# EAGLE board 68EC020TK-V01 (EAGLE 6.6.0), part 1 of 2
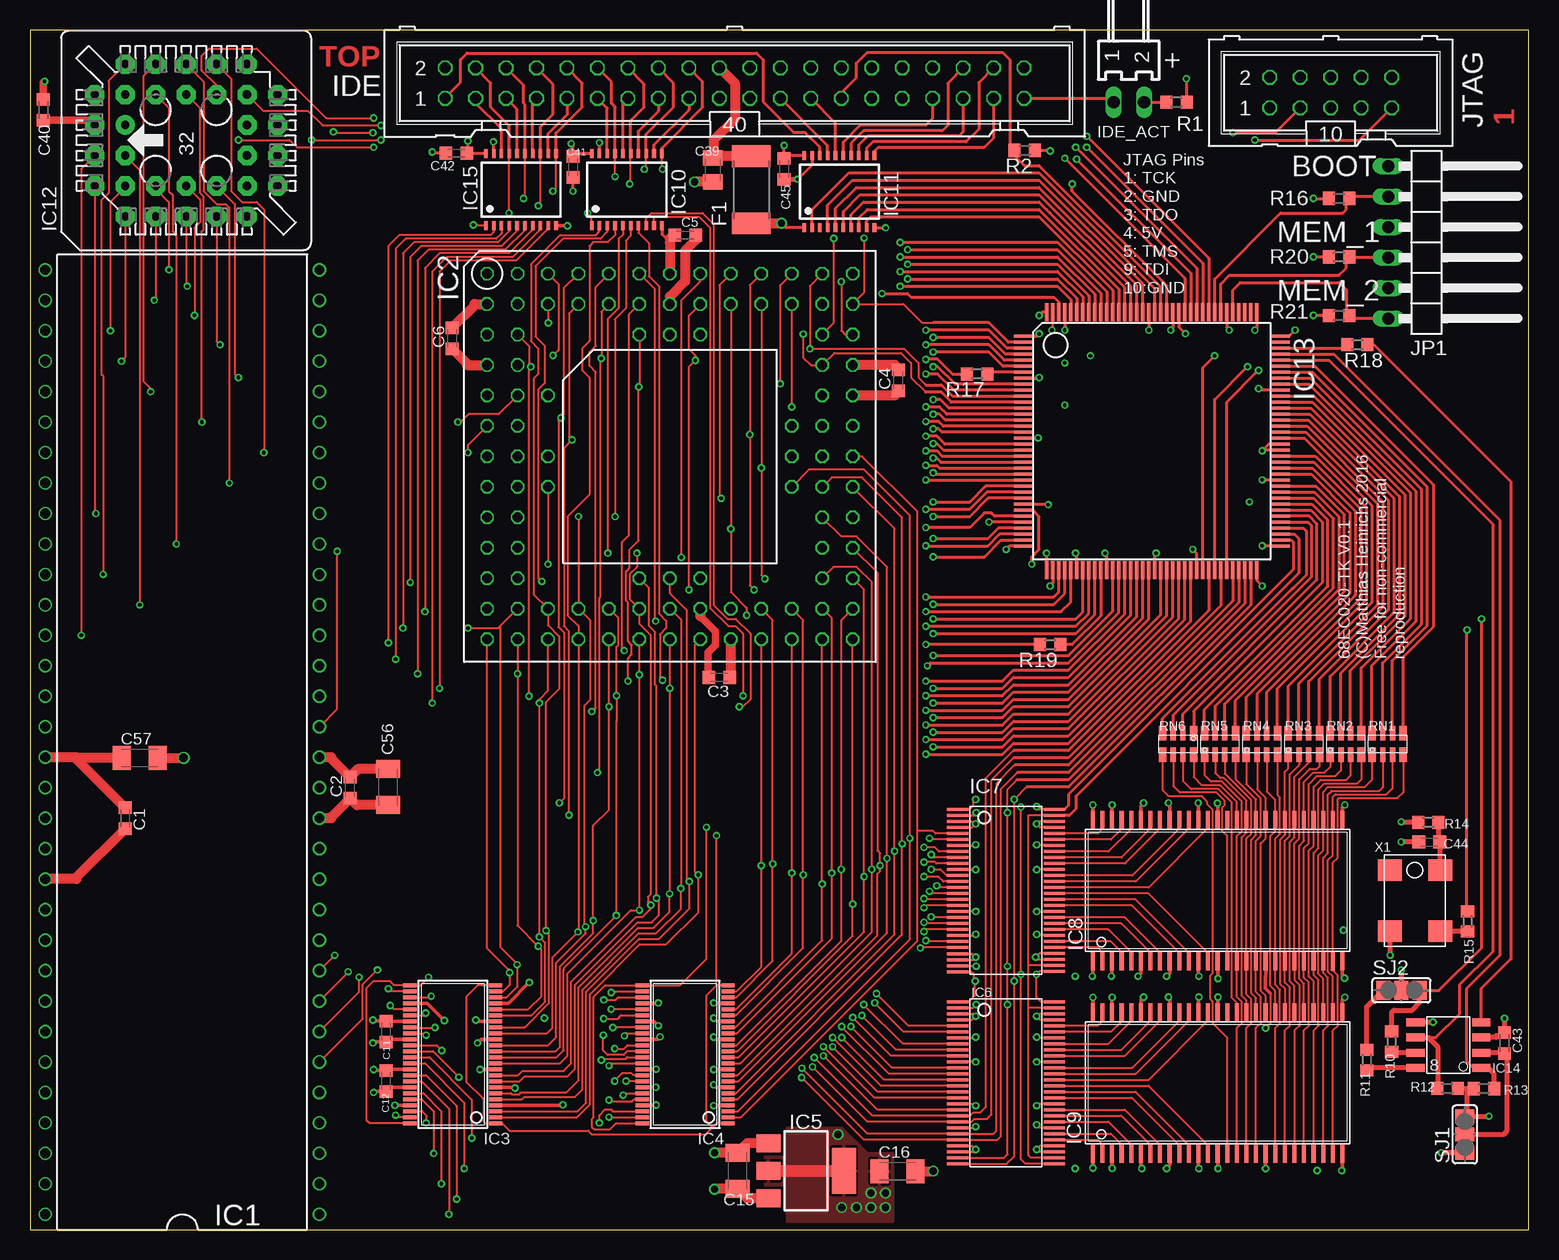
[diagram p4: board, top side]
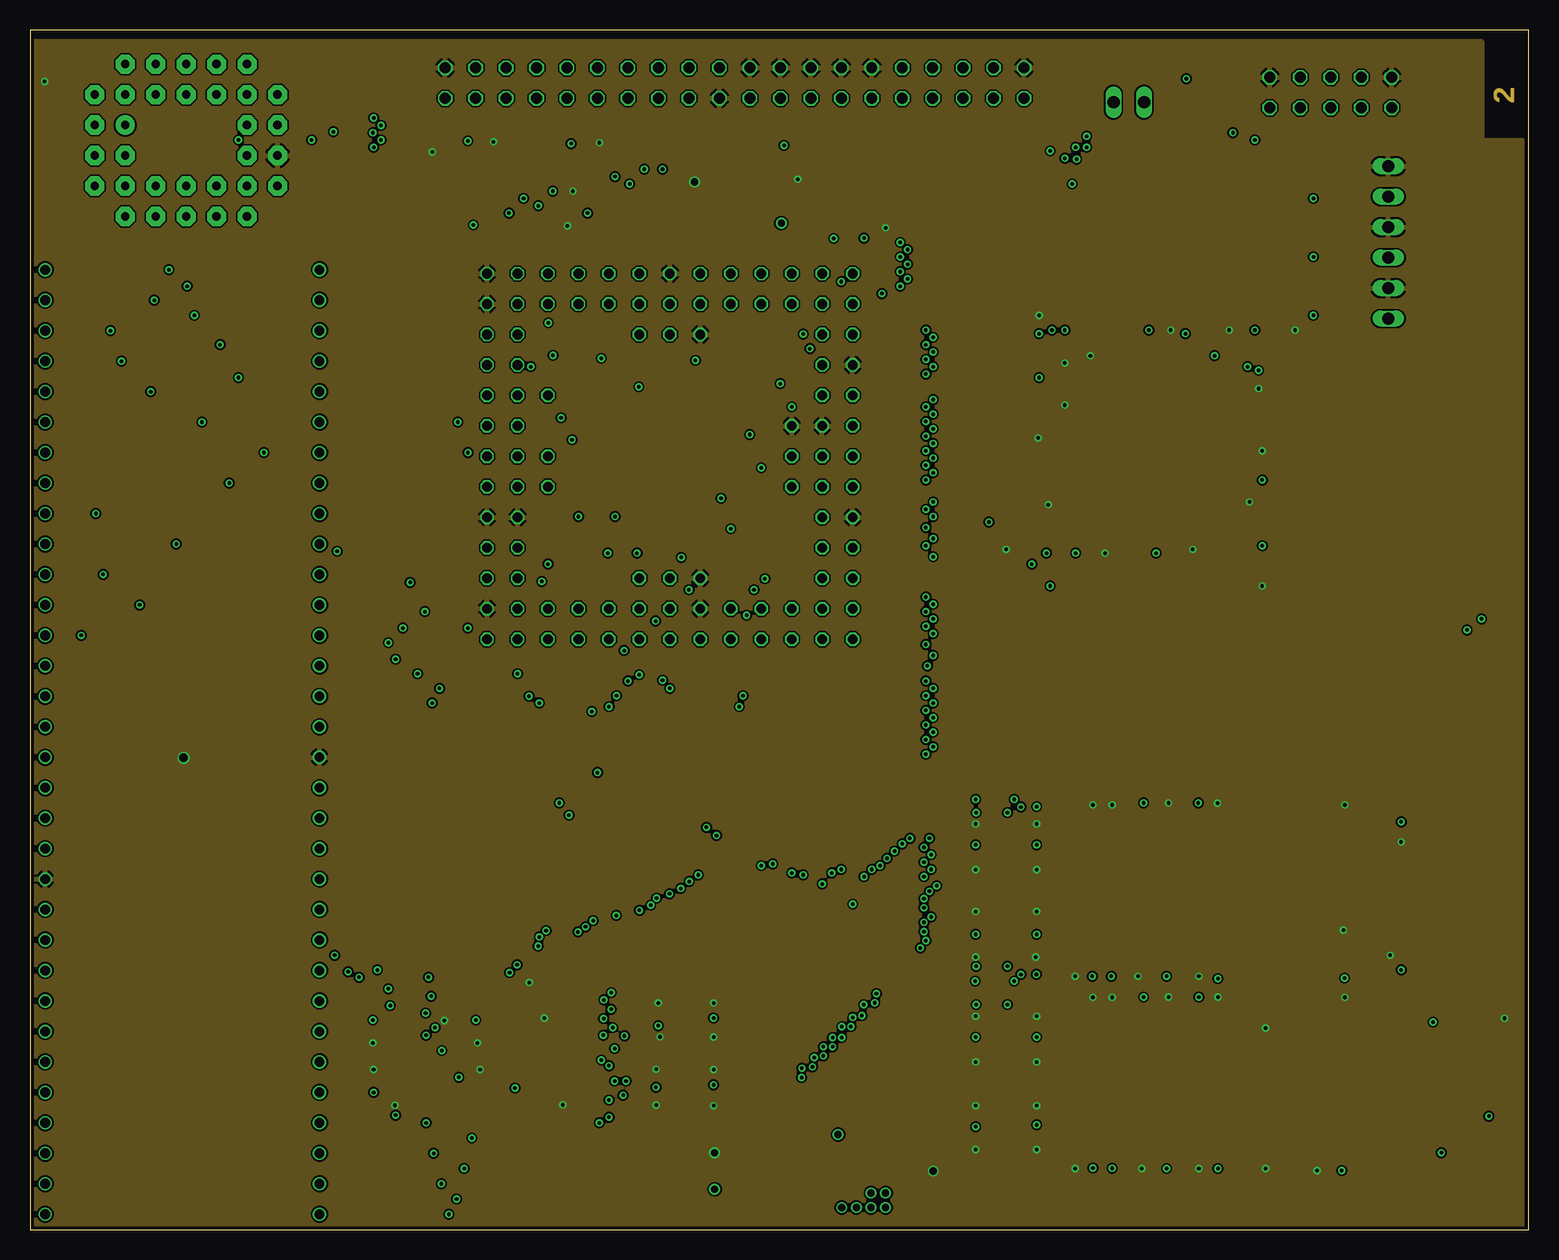
[diagram p5: board, inner layer Route2]
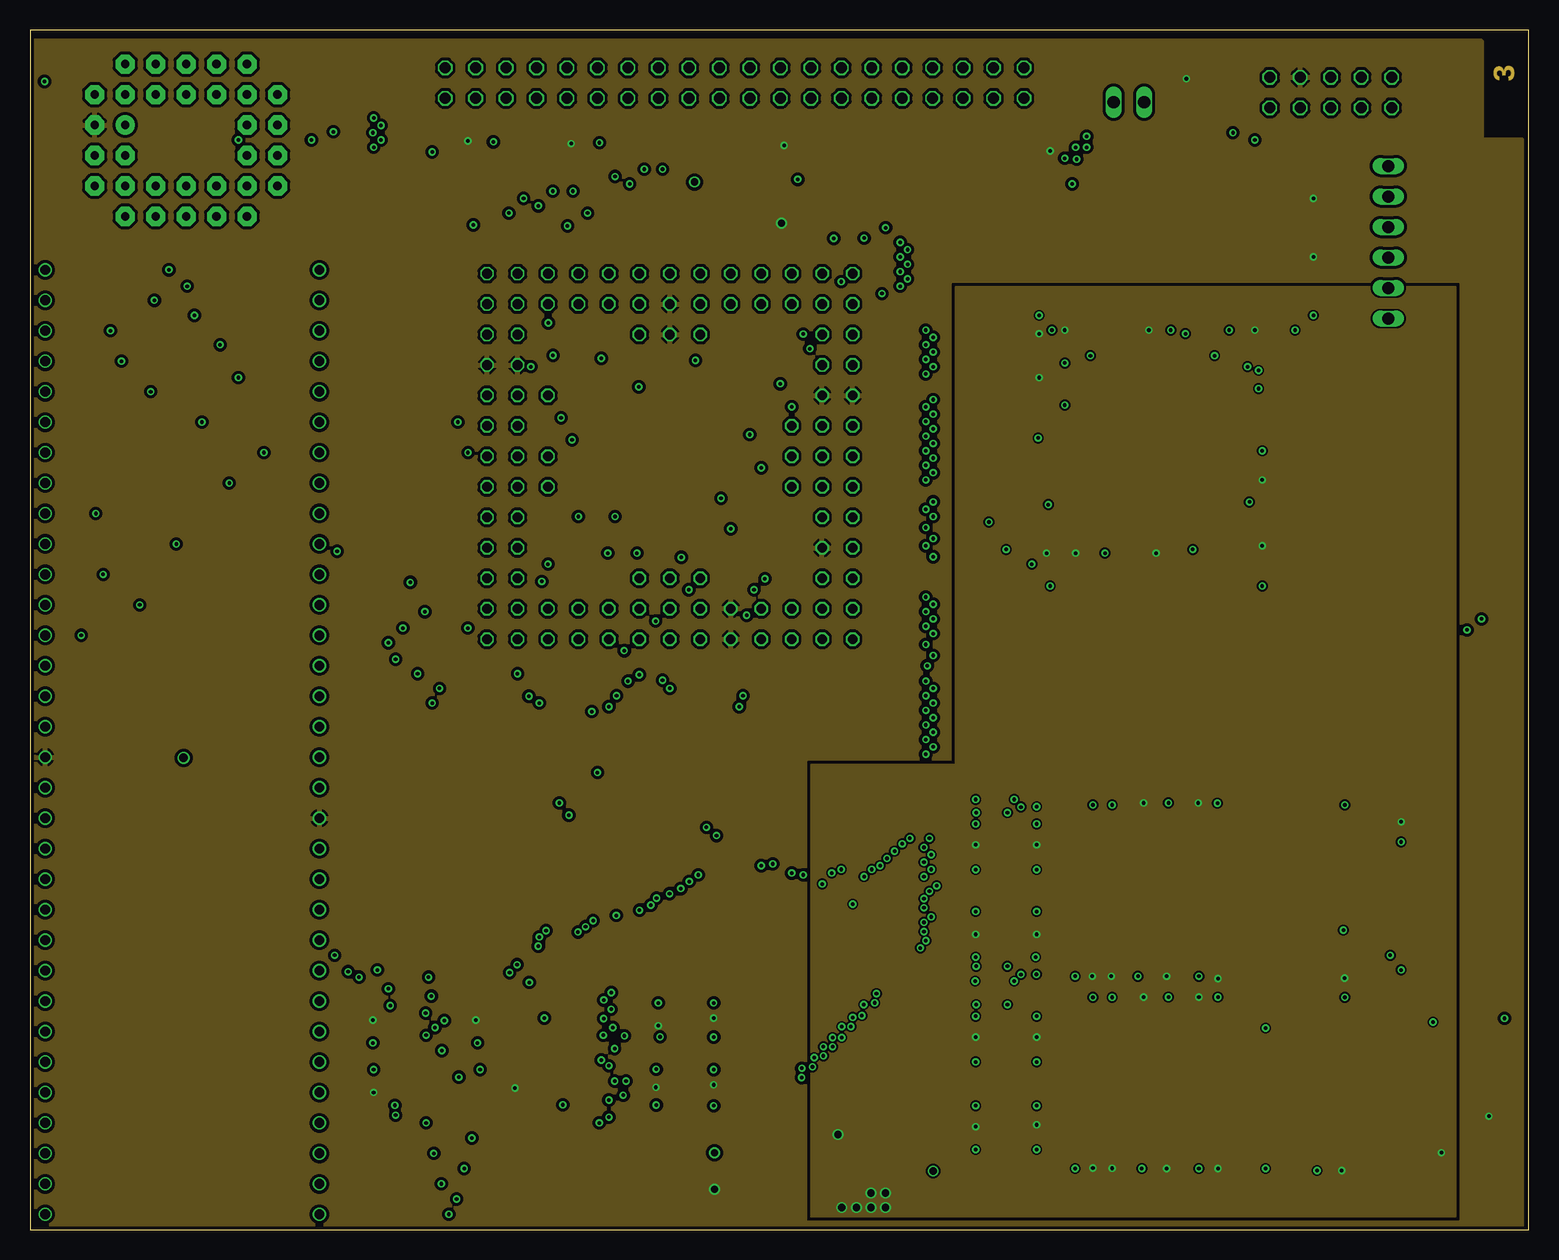
[diagram p6: board, inner layer Route15]
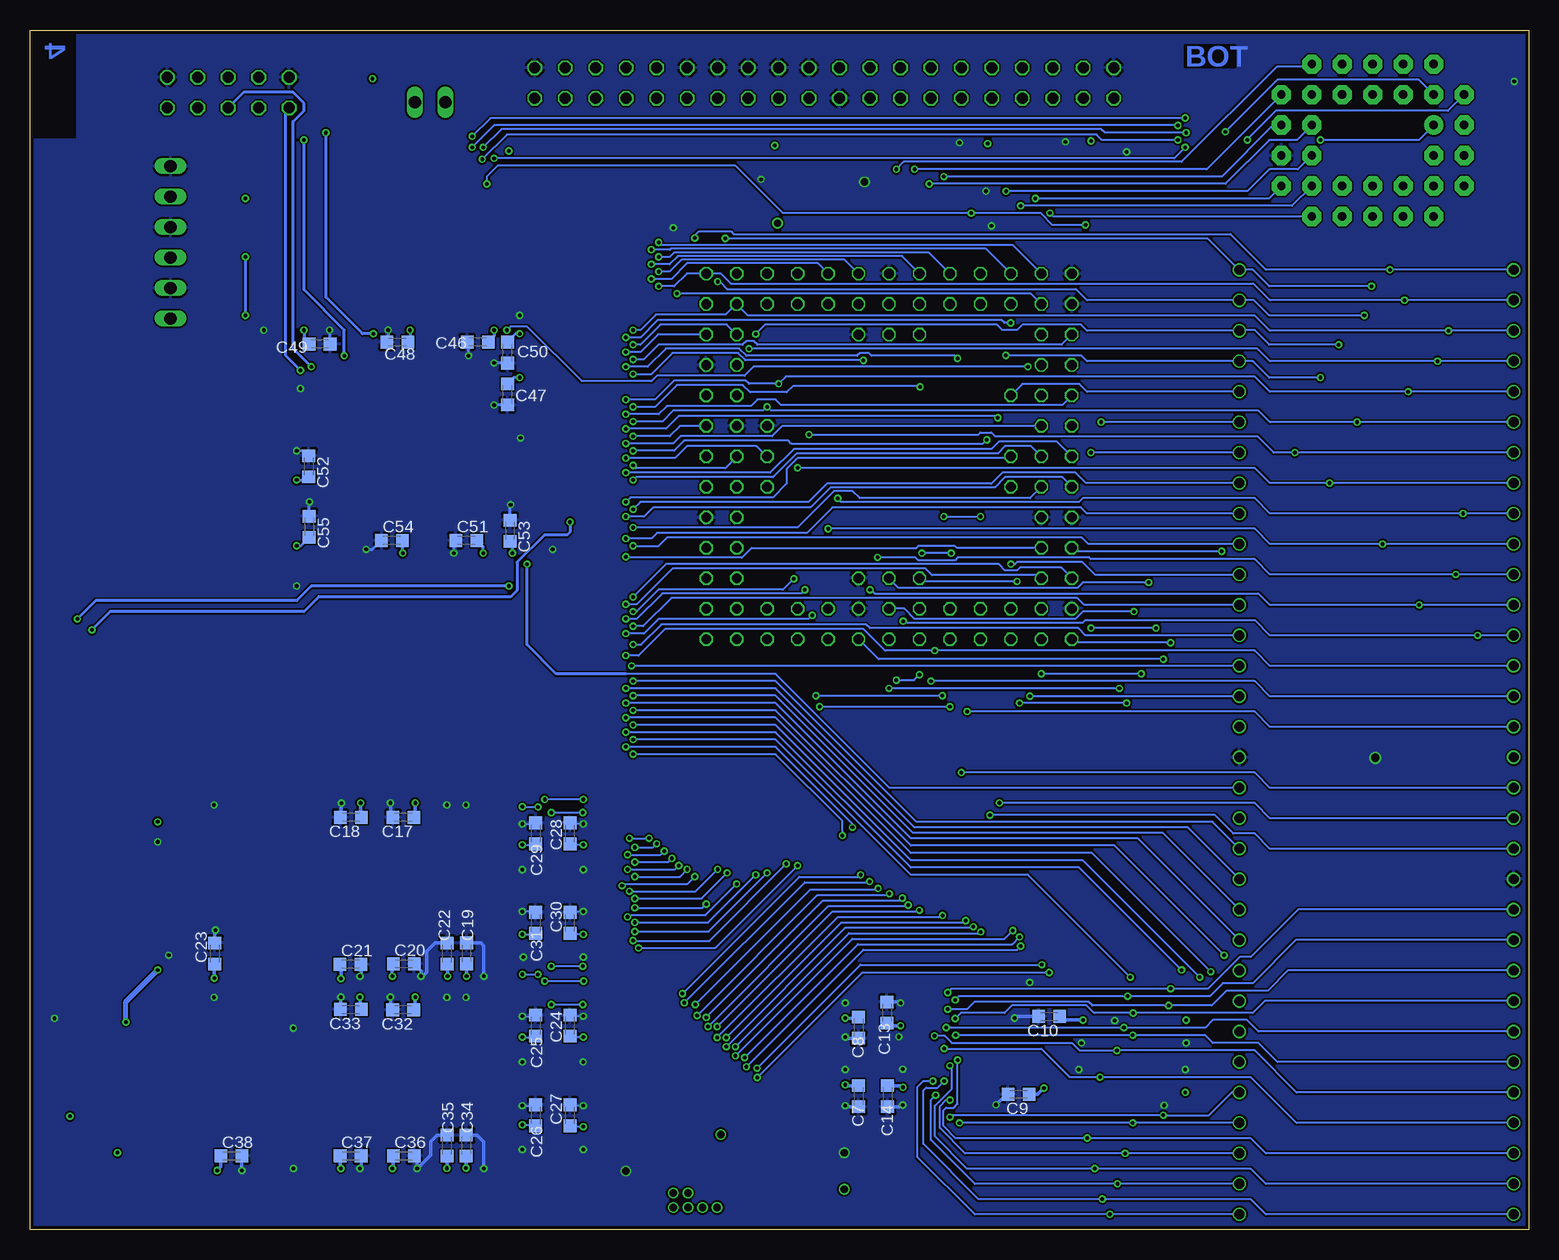
[diagram p7: board, bottom side, seen from below]

Size 124.95 x 100 mm. Coordinates in mm from the lower left corner, seen from the top.
Outline: 0,0 124.95,0 124.95,100 0,100 0,0
Copper layers (1+2*15+16): Top 0.035mm / dielectric 0.36mm / Route2 0.035mm / dielectric 0.71mm / Route15 0.035mm / dielectric 0.36mm / Bottom 0.035mm
Design rules "LeitOn - Standard-Eagle-DRU - 4-Lagen Multilayer - deutsch - Rev 2.0 *": minimum track width 0.15mm, minimum drill 0.3mm, track to track 0.15mm, track to pad 0.15mm, pad to pad 0.15mm, via to via 0.15mm, smd to smd 0.15mm, copper to edge 0.3mm, drill to drill 0.3mm, minimum pad ring 0.15mm, minimum via ring 0.15mm, stop-mask expansion 0.075mm, vias tented up to drill 0mil, thermal gap 0.2mm

## Footprints (pad centres in the part's own frame; a part is rotated, then mirrored left to right if it is on the bottom)
C0603K = smd 1.05 x 1.08: 1 -0.875,0; 2 0.875,0
C1206K = smd 1.5 x 2: 1 -1.5,0; 2 1.5,0
C0805K = smd 1.3 x 1.6: 1 -1,0; 2 1,0
R2512 = smd 1.8 x 3.2: 1 -2.8,0; 2 2.8,0
DIL64-ROUND = drill 0.813: 1 -38.1,-11.43; 2 -35.56,-11.43; 3 -33.02,-11.43; 4 -30.48,-11.43; 5 -27.94,-11.43; 6 -25.4,-11.43; 7 -22.86,-11.43; 8 -20.32,-11.43; 9 -17.78,-11.43; 10 -15.24,-11.43; 11 -12.7,-11.43; 12 -10.16,-11.43; 13 -7.62,-11.43; 14 -5.08,-11.43; 15 -2.54,-11.43; 16 0,-11.43; 17 2.54,-11.43; 18 5.08,-11.43; 19 7.62,-11.43; 20 10.16,-11.43; 21 12.7,-11.43; 22 15.24,-11.43; 23 17.78,-11.43; 24 20.32,-11.43; 25 22.86,-11.43; 26 25.4,-11.43; 27 27.94,-11.43; 28 30.48,-11.43; 29 33.02,-11.43; 30 35.56,-11.43; 31 38.1,-11.43; 32 40.64,-11.43; 33 40.64,11.43; 34 38.1,11.43; 35 35.56,11.43; 36 33.02,11.43; 37 30.48,11.43; 38 27.94,11.43; 39 25.4,11.43; 40 22.86,11.43; 41 20.32,11.43; 42 17.78,11.43; 43 15.24,11.43; 44 12.7,11.43; 45 10.16,11.43; 46 7.62,11.43; 47 5.08,11.43; 48 2.54,11.43; 49 0,11.43; 50 -2.54,11.43; 51 -5.08,11.43; 52 -7.62,11.43; 53 -10.16,11.43; 54 -12.7,11.43; 55 -15.24,11.43; 56 -17.78,11.43; 57 -20.32,11.43; 58 -22.86,11.43; 59 -25.4,11.43; 60 -27.94,11.43; 61 -30.48,11.43; 62 -33.02,11.43; 63 -35.56,11.43; 64 -38.1,11.43
MPGA114EC = drill 0.813 octagon: A01 -15.24,15.24; A02 -12.7,15.24; A03 -10.16,15.24; A04 -7.62,15.24; A05 -5.08,15.24; A06 -2.54,15.24; A07 0,15.24; A08 2.54,15.24; A09 5.08,15.24; A10 7.62,15.24; A11 10.16,15.24; A12 12.7,15.24; A13 15.24,15.24; B01 -15.24,12.7; B02 -12.7,12.7; B03 -10.16,12.7; B04 -7.62,12.7; B05 -5.08,12.7; B06 -2.54,12.7; B07 0,12.7; B08 2.54,12.7; B09 5.08,12.7; B10 7.62,12.7; B11 10.16,12.7; B12 12.7,12.7; B13 15.24,12.7; C01 -15.24,10.16; C02 -12.7,10.16; C06 -2.54,10.16; C07 0,10.16; C08 2.54,10.16; C12 12.7,10.16; C13 15.24,10.16; D01 -15.24,7.62; D02 -12.7,7.62; D12 12.7,7.62; D13 15.24,7.62; E01 -15.24,5.08; E02 -12.7,5.08; E03 -10.16,5.08; E12 12.7,5.08; E13 15.24,5.08; F01 -15.24,2.54; F02 -12.7,2.54; F11 10.16,2.54; F12 12.7,2.54; F13 15.24,2.54; G01 -15.24,0; G02 -12.7,0; G03 -10.16,0; G11 10.16,0; G12 12.7,0; G13 15.24,0; H01 -15.24,-2.54; H02 -12.7,-2.54; H03 -10.16,-2.54; H11 10.16,-2.54; H12 12.7,-2.54; H13 15.24,-2.54; J01 -15.24,-5.08; J02 -12.7,-5.08; J12 12.7,-5.08; J13 15.24,-5.08; K01 -15.24,-7.62; K02 -12.7,-7.62; K12 12.7,-7.62; K13 15.24,-7.62; L01 -15.24,-10.16; L02 -12.7,-10.16; L06 -2.54,-10.16; L07 0,-10.16; L08 2.54,-10.16; L12 12.7,-10.16; L13 15.24,-10.16; M01 -15.24,-12.7; M02 -12.7,-12.7; M03 -10.16,-12.7; M04 -7.62,-12.7; M05 -5.08,-12.7; M06 -2.54,-12.7; M07 0,-12.7; M08 2.54,-12.7; M09 5.08,-12.7; M10 7.62,-12.7; M11 10.16,-12.7; M12 12.7,-12.7; M13 15.24,-12.7; N01 -15.24,-15.24; N02 -12.7,-15.24; N03 -10.16,-15.24; N04 -7.62,-15.24; N05 -5.08,-15.24; N06 -2.54,-15.24; N07 0,-15.24; N08 2.54,-15.24; N09 5.08,-15.24; N10 7.62,-15.24; N11 10.16,-15.24; N12 12.7,-15.24; N13 15.24,-15.24
TSSOP48 = smd 0.3 x 1.1: 1 -5.75,-3.575; 2 -5.25,-3.575; 3 -4.75,-3.575; 4 -4.25,-3.575; 5 -3.75,-3.575; 6 -3.25,-3.575; 7 -2.75,-3.575; 8 -2.25,-3.575; 9 -1.75,-3.575; 10 -1.25,-3.575; 11 -0.75,-3.575; 12 -0.25,-3.575; 13 0.25,-3.575; 14 0.75,-3.575; 15 1.25,-3.575; 16 1.75,-3.575; 17 2.25,-3.575; 18 2.75,-3.575; 19 3.25,-3.575; 20 3.75,-3.575; 21 4.25,-3.575; 22 4.75,-3.575; 23 5.25,-3.575; 24 5.75,-3.575; 25 5.75,3.575; 26 5.25,3.575; 27 4.75,3.575; 28 4.25,3.575; 29 3.75,3.575; 30 3.25,3.575; 31 2.75,3.575; 32 2.25,3.575; 33 1.75,3.575; 34 1.25,3.575; 35 0.75,3.575; 36 0.25,3.575; 37 -0.25,3.575; 38 -0.75,3.575; 39 -1.25,3.575; 40 -1.75,3.575; 41 -2.25,3.575; 42 -2.75,3.575; 43 -3.25,3.575; 44 -3.75,3.575; 45 -4.25,3.575; 46 -4.75,3.575; 47 -5.25,3.575; 48 -5.75,3.575
SOT223 = smd 1.5 x 2: 1 -2.3,-3.15; 2 0,-3.15; 3 2.3,-3.15 | smd 3.8 x 2: 4 0,3.15
TSSOP56@2 = smd 0.254 x 1.778: 1 -6.762,-4.023; 2 -6.262,-4.023; 3 -5.762,-4.023; 4 -5.262,-4.023; 5 -4.762,-4.023; 6 -4.262,-4.023; 7 -3.762,-4.023; 8 -3.262,-4.023; 9 -2.762,-4.023; 10 -2.262,-4.023; 11 -1.762,-4.023; 12 -1.262,-4.023; 13 -0.762,-4.023; 14 -0.262,-4.023; 15 0.238,-4.023; 16 0.738,-4.023; 17 1.238,-4.023; 18 1.738,-4.023; 19 2.238,-4.023; 20 2.738,-4.023; 21 3.238,-4.023; 22 3.738,-4.023; 23 4.238,-4.023; 24 4.738,-4.023; 25 5.262,-4.023; 26 5.762,-4.023; 27 6.262,-4.023; 28 6.762,-4.023; 29 6.738,4.023; 30 6.238,4.023; 31 5.738,4.023; 32 5.238,4.023; 33 4.738,4.023; 34 4.238,4.023; 35 3.738,4.023; 36 3.238,4.023; 37 2.738,4.023; 38 2.238,4.023; 39 1.738,4.023; 40 1.238,4.023; 41 0.738,4.023; 42 0.238,4.023; 43 -0.262,4.023; 44 -0.762,4.023; 45 -1.262,4.023; 46 -1.762,4.023; 47 -2.262,4.023; 48 -2.762,4.023; 49 -3.262,4.023; 50 -3.762,4.023; 51 -4.262,4.023; 52 -4.762,4.023; 53 -5.262,4.023; 54 -5.762,4.023; 55 -6.262,4.023; 56 -6.762,4.023
TSOP2-54@2 = smd 0.34 x 1.5: 1 -9,-5.9; 2 -8.2,-5.9; 3 -7.4,-5.9; 4 -6.6,-5.9; 5 -5.8,-5.9; 6 -5,-5.9; 7 -4.2,-5.9; 8 -3.4,-5.9; 9 -2.6,-5.9; 10 -1.8,-5.9; 11 -1,-5.9; 12 -0.2,-5.9; 13 0.6,-5.9; 14 1.4,-5.9; 15 2.2,-5.9; 16 3,-5.9; 17 3.8,-5.9; 18 4.6,-5.9; 19 5.4,-5.9; 20 6.2,-5.9; 21 7,-5.9; 22 7.8,-5.9; 23 8.6,-5.9; 24 9.4,-5.9; 25 10.2,-5.9; 26 11,-5.9; 27 11.8,-5.9; 28 11.8,5.9; 29 11,5.9; 30 10.2,5.9; 31 9.4,5.9; 32 8.6,5.9; 33 7.8,5.9; 34 7,5.9; 35 6.2,5.9; 36 5.4,5.9; 37 4.6,5.9; 38 3.8,5.9; 39 3,5.9; 40 2.2,5.9; 41 1.4,5.9; 42 0.6,5.9; 43 -0.2,5.9; 44 -1,5.9; 45 -1.8,5.9; 46 -2.6,5.9; 47 -3.4,5.9; 48 -4.2,5.9; 49 -5,5.9; 50 -5.8,5.9; 51 -6.6,5.9; 52 -7.4,5.9; 53 -8.2,5.9; 54 -9,5.9
TSSOP20 = smd 0.3 x 0.75: 1 -2.925,-3; 2 -2.275,-3; 3 -1.625,-3; 4 -0.975,-3; 5 -0.325,-3; 6 0.325,-3; 7 0.975,-3; 8 1.625,-3; 9 2.275,-3; 10 2.925,-3; 11 2.925,3; 12 2.275,3; 13 1.625,3; 14 0.975,3; 15 0.325,3; 16 -0.325,3; 17 -0.975,3; 18 -1.625,3; 19 -2.275,3; 20 -2.925,3
PLCC-SR32 = drill 0.7 pad 1.6: 1 1.27,5.08 | drill 0.7 pad 1.6 octagon: 2 -1.27,7.62; 3 -1.27,5.08; 4 -3.81,7.62; 5 -6.35,5.08; 6 -3.81,5.08; 7 -6.35,2.54; 8 -3.81,2.54; 9 -6.35,0; 10 -3.81,0; 11 -6.35,-2.54; 12 -3.81,-2.54; 13 -6.35,-5.08; 14 -3.81,-7.62; 15 -3.81,-5.08; 16 -1.27,-7.62; 17 -1.27,-5.08; 18 1.27,-7.62; 19 1.27,-5.08; 20 3.81,-7.62; 21 6.35,-5.08; 22 3.81,-5.08; 23 6.35,-2.54; 24 3.81,-2.54; 25 6.35,0; 26 3.81,0; 27 6.35,2.54; 28 3.81,2.54; 29 6.35,5.08; 30 3.81,7.62; 31 3.81,5.08; 32 1.27,7.62
TQFP144 = smd 0.27 x 1.5: 1 -8.75,-10.75; 2 -8.25,-10.75; 3 -7.75,-10.75; 4 -7.25,-10.75; 5 -6.75,-10.75; 6 -6.25,-10.75; 7 -5.75,-10.75; 8 -5.25,-10.75; 9 -4.75,-10.75; 10 -4.25,-10.75; 11 -3.75,-10.75; 12 -3.25,-10.75; 13 -2.75,-10.75; 14 -2.25,-10.75; 15 -1.75,-10.75; 16 -1.25,-10.75; 17 -0.75,-10.75; 18 -0.25,-10.75; 19 0.25,-10.75; 20 0.75,-10.75; 21 1.25,-10.75; 22 1.75,-10.75; 23 2.25,-10.75; 24 2.75,-10.75; 25 3.25,-10.75; 26 3.75,-10.75; 27 4.25,-10.75; 28 4.75,-10.75; 29 5.25,-10.75; 30 5.75,-10.75; 31 6.25,-10.75; 32 6.75,-10.75; 33 7.25,-10.75; 34 7.75,-10.75; 35 8.25,-10.75; 36 8.75,-10.75; 73 8.75,10.75; 74 8.25,10.75; 75 7.75,10.75; 76 7.25,10.75; 77 6.75,10.75; 78 6.25,10.75; 79 5.75,10.75; 80 5.25,10.75; 81 4.75,10.75; 82 4.25,10.75; 83 3.75,10.75; 84 3.25,10.75; 85 2.75,10.75; 86 2.25,10.75; 87 1.75,10.75; 88 1.25,10.75; 89 0.75,10.75; 90 0.25,10.75; 91 -0.25,10.75; 92 -0.75,10.75; 93 -1.25,10.75; 94 -1.75,10.75; 95 -2.25,10.75; 96 -2.75,10.75; 97 -3.25,10.75; 98 -3.75,10.75; 99 -4.25,10.75; 100 -4.75,10.75; 101 -5.25,10.75; 102 -5.75,10.75; 103 -6.25,10.75; 104 -6.75,10.75; 105 -7.25,10.75; 106 -7.75,10.75; 107 -8.25,10.75; 108 -8.75,10.75 | smd 1.5 x 0.27: 37 10.75,-8.75; 38 10.75,-8.25; 39 10.75,-7.75; 40 10.75,-7.25; 41 10.75,-6.75; 42 10.75,-6.25; 43 10.75,-5.75; 44 10.75,-5.25; 45 10.75,-4.75; 46 10.75,-4.25; 47 10.75,-3.75; 48 10.75,-3.25; 49 10.75,-2.75; 50 10.75,-2.25; 51 10.75,-1.75; 52 10.75,-1.25; 53 10.75,-0.75; 54 10.75,-0.25; 55 10.75,0.25; 56 10.75,0.75; 57 10.75,1.25; 58 10.75,1.75; 59 10.75,2.25; 60 10.75,2.75; 61 10.75,3.25; 62 10.75,3.75; 63 10.75,4.25; 64 10.75,4.75; 65 10.75,5.25; 66 10.75,5.75; 67 10.75,6.25; 68 10.75,6.75; 69 10.75,7.25; 70 10.75,7.75; 71 10.75,8.25; 72 10.75,8.75; 109 -10.75,8.75; 110 -10.75,8.25; 111 -10.75,7.75; 112 -10.75,7.25; 113 -10.75,6.75; 114 -10.75,6.25; 115 -10.75,5.75; 116 -10.75,5.25; 117 -10.75,4.75; 118 -10.75,4.25; 119 -10.75,3.75; 120 -10.75,3.25; 121 -10.75,2.75; 122 -10.75,2.25; 123 -10.75,1.75; 124 -10.75,1.25; 125 -10.75,0.75; 126 -10.75,0.25; 127 -10.75,-0.25; 128 -10.75,-0.75; 129 -10.75,-1.25; 130 -10.75,-1.75; 131 -10.75,-2.25; 132 -10.75,-2.75; 133 -10.75,-3.25; 134 -10.75,-3.75; 135 -10.75,-4.25; 136 -10.75,-4.75; 137 -10.75,-5.25; 138 -10.75,-5.75; 139 -10.75,-6.25; 140 -10.75,-6.75; 141 -10.75,-7.25; 142 -10.75,-7.75; 143 -10.75,-8.25; 144 -10.75,-8.75
SO-8 = smd 0.66 x 1.524: 1 -1.27,-2.743; 2 0,-2.743; 3 1.27,-2.743; 4 2.54,-2.743; 5 2.54,2.743; 6 1.27,2.743; 7 0,2.743; 8 -1.27,2.743
ML40 = drill 0.914 octagon: 1 -24.13,-1.27; 2 -24.13,1.27; 3 -21.59,-1.27; 4 -21.59,1.27; 5 -19.05,-1.27; 6 -19.05,1.27; 7 -16.51,-1.27; 8 -16.51,1.27; 9 -13.97,-1.27; 10 -13.97,1.27; 11 -11.43,-1.27; 12 -11.43,1.27; 13 -8.89,-1.27; 14 -8.89,1.27; 15 -6.35,-1.27; 16 -6.35,1.27; 17 -3.81,-1.27; 18 -3.81,1.27; 19 -1.27,-1.27; 20 -1.27,1.27; 21 1.27,-1.27; 22 1.27,1.27; 23 3.81,-1.27; 24 3.81,1.27; 25 6.35,-1.27; 26 6.35,1.27; 27 8.89,-1.27; 28 8.89,1.27; 29 11.43,-1.27; 30 11.43,1.27; 31 13.97,-1.27; 32 13.97,1.27; 33 16.51,-1.27; 34 16.51,1.27; 35 19.05,-1.27; 36 19.05,1.27; 37 21.59,-1.27; 38 21.59,1.27; 39 24.13,-1.27; 40 24.13,1.27
7395-02 = drill 1.016 long: 1 1.27,0; 2 -1.27,0
1X06/90 = drill 1.016 long: 1 -6.35,-3.81; 2 -3.81,-3.81; 3 -1.27,-3.81; 4 1.27,-3.81; 5 3.81,-3.81; 6 6.35,-3.81
ML10 = drill 0.914 octagon: 1 -5.08,-1.27; 2 -5.08,1.27; 3 -2.54,-1.27; 4 -2.54,1.27; 5 0,-1.27; 6 0,1.27; 7 2.54,-1.27; 8 2.54,1.27; 9 5.08,-1.27; 10 5.08,1.27
R0603 = smd 1 x 1.1: 1 -0.85,0; 2 0.85,0
R-NETZ@2 = smd 0.63 x 1.2: P$1 -1.3,-0.9; P$4 1.3,-0.9; P$5 1.3,0.9; P$8 -1.3,0.9 | smd 0.45 x 1.2: P$2 -0.4,-0.9; P$3 0.4,-0.9; P$6 0.4,0.9; P$7 -0.4,0.9
SJ_2 = smd 1.168 x 1.6: 1 -1.524,0; 2 0,0; 3 1.524,0
7X5 = smd 1.8 x 2: P$1 -2.54,-2.1; P$2 2.54,-2.1; P$3 2.54,2.1; P$4 -2.54,2.1

## Placement (x,y rotation side)
C1  100nF  [C0603K]  7.94,34.29 270 top
C2  100nF  [C0603K]  26.67,36.83 90 top
C3  100nF  [C0603K]  57.47,46.04 180 top
C4  100nF  [C0603K]  72.39,70.8 90 top
C5  100nF  [C0603K]  54.61,82.89 180 top
C6  100nF  [C0603K]  35.2,74.3 90 top
C7  100nF  [C0603K]  55.88,11.11 270 bottom
C8  100nF  [C0603K]  55.88,16.83 270 bottom
C9  100nF  [C0603K]  42.55,11.27 180 bottom
C10  100nF  [C0603K]  40.01,17.76 180 bottom
C11  100nF  [C0603K]  29.69,16.51 270 top
C12  100nF  [C0603K]  29.69,12.38 90 top
C13  100nF  [C0603K]  53.5,18.1 90 bottom
C14  100nF  [C0603K]  53.45,11.12 270 bottom
C15  47uF  [C1206K]  58.98,4.9 90 top
C16  47uF  [C1206K]  72.32,4.86 0 top
C17  100nF  [C0603K]  93.82,34.37 180 bottom
C18  100nF  [C0603K]  98.21,34.37 180 bottom
C19  100nF  [C0603K]  88.55,23.02 90 bottom
C20  100nF  [C0603K]  93.8,22.14 0 bottom
C21  100nF  [C0603K]  98.23,22.12 0 bottom
C22  100nF  [C0603K]  90.18,23.01 90 bottom
C23  100nF  [C0603K]  109.54,23.01 90 bottom
C24  10nF  [C0603K]  79.94,16.99 90 bottom
C25  10nF  [C0603K]  82.8,16.99 90 bottom
C26  10nF  [C0603K]  82.8,9.53 90 bottom
C27  10nF  [C0603K]  79.94,9.53 90 bottom
C28  10nF  [C0603K]  79.94,33.02 90 bottom
C29  10nF  [C0603K]  82.8,33.02 90 bottom
C30  10nF  [C0603K]  79.94,25.56 90 bottom
C31  10nF  [C0603K]  82.8,25.56 90 bottom
C32  100nF  [C0603K]  93.84,18.32 180 bottom
C33  100nF  [C0603K]  98.19,18.35 180 bottom
C34  100nF  [C0603K]  88.58,6.99 90 bottom
C35  100nF  [C0603K]  90.19,6.99 90 bottom
C36  100nF  [C0603K]  93.79,6.13 0 bottom
C37  100nF  [C0603K]  98.22,6.13 0 bottom
C38  100nF  [C0603K]  108.16,6.13 0 bottom
C39  47µF  [C0805K]  56.92,88.34 270 top
C40  100nF  [C0603K]  1.11,93.34 90 top
C41  100nF  [C0603K]  45.28,88.58 270 top
C42  100nF  [C0603K]  35.55,89.73 180 top
C43  [C0603K]  122.92,15.54 90 top
C44  [C0603K]  116.65,32.3 180 top
C45  100nF  [C0603K]  62.87,88.42 270 top
C46  100nF  [C0603K]  87.63,73.99 0 bottom
C47  100nF  [C0603K]  85.15,69.61 90 bottom
C48  100nF  [C0603K]  94.32,73.98 0 bottom
C49  100nF  [C0603K]  100.81,73.82 180 bottom
C50  100nF  [C0603K]  85.15,73.11 90 bottom
C51  100nF  [C0603K]  88.58,57.45 0 bottom
C52  100nF  [C0603K]  101.71,63.63 270 bottom
C53  100nF  [C0603K]  84.93,58.26 270 bottom
C54  100nF  [C0603K]  94.77,57.45 0 bottom
C55  100nF  [C0603K]  101.66,58.59 270 bottom
C56  47uF  [C1206K]  29.87,36.88 90 top
C57  47uF  [C1206K]  9.14,39.32 0 top
F1  500mA  [R2512]  60.13,86.68 270 top
IC1  [DIL64-ROUND]  12.7,39.37 90 top
IC2  MC68EC020RP  [MPGA114EC]  53.34,64.45 0 top
IC3  74ACT16245  [TSSOP48]  35.24,14.61 90 top
IC4  74ACT16245  [TSSOP48]  54.61,14.61 90 top
IC5  LD117AS33TR  [SOT223]  64.69,4.9 270 top
IC6  74ALVT16543  [TSSOP56@2]  81.37,12.22 270 top
IC7  74ALVT16543  [TSSOP56@2]  81.37,28.26 270 top
IC8  K4S56163  [TSOP2-54@2]  97.6,28.26 0 top
IC9  K4S56163  [TSOP2-54@2]  97.6,12.22 0 top
IC10  74HCT245PW  [TSSOP20]  49.75,86.68 0 top
IC11  74HCT245PW  [TSSOP20]  67.47,86.52 0 top
IC12  AM29F010S  [PLCC-SR32]  13.02,90.81 90 top
IC13  XC95288XL-TQ144  [TQFP144]  93.5,65.72 270 top
IC14  ICS570B  [SO-8]  118.24,14.74 90 top
IC15  74HCT245PW  [TSSOP20]  40.93,86.68 0 top
IDE  [ML40]  58.74,95.57 0 top
IDE_ACT  22-05-7028-02  [7395-02]  91.6,93.98 180 top
JP1  [1X06/90]  117.04,82.3 270 top
JTAG  [ML10]  108.43,94.77 0 top
R1  330  [R0603]  95.57,93.98 0 top
R2  4.7k  [R0603]  82.93,89.96 180 top
R10  33  [R0603]  113.51,15.67 90 top
R11  33  [R0603]  111.44,14.14 90 top
R12  4.7k  [R0603]  118.15,11.76 0 top
R13  4.7k  [R0603]  121.2,11.75 180 top
R14  [R0603]  116.56,33.95 180 top
R15  33  [R0603]  119.83,25.69 270 top
R16  4.7k  [R0603]  109.12,85.95 0 top
R17  33  [R0603]  78.94,71.32 180 top
R18  33  [R0603]  110.64,73.76 180 top
R19  33  [R0603]  85.04,48.77 180 top
R20  4.7k  [R0603]  109.12,81.08 0 top
R21  4.7k  [R0603]  109.12,76.2 0 top
RN1  33R  [R-NETZ@2]  113.17,40.47 0 top
RN2  33R  [R-NETZ@2]  109.68,40.47 0 top
RN3  33R  [R-NETZ@2]  106.18,40.47 0 top
RN4  33R  [R-NETZ@2]  102.69,40.47 0 top
RN5  33R  [R-NETZ@2]  99.2,40.47 0 top
RN6  33R  [R-NETZ@2]  95.71,40.47 180 top
SJ1  [SJ_2]  119.61,7.92 90 top
SJ2  [SJ_2]  114.33,19.95 0 top
X1  [7X5]  115.44,27.42 270 top

## Tracks (layer width: path | path; a pad name or v marks a point on that pad's centre or on a via)
!AS00  (via drill 0.3)
  Top 0.152: IC1.6 27.74,17.58 27.74,20.42 v28.96,21.64
  Top 0.254: v75.29,41.45 81.08,41.45 81.99,42.37 86.56,42.37 95.25,51.06 IC13.58
  Bottom 0.152: v28.96,21.64 37.49,30.18 51.51,30.18 62.79,41.45 v75.29,41.45
!AS20  (via drill 0.3)
  Top 0.254: v75.29,56.08 79.55,56.08 80.94,57.47 IC13.35
  Bottom 0.152: IC2.K02 47.69,56.83 47.85,57 50.9,57 51.07,56.83 64.78,56.83 65.61,56.01 75.21,56.01 v75.29,56.08
!BERR  (via drill 0.3)
  Top 0.152: IC2.H03 v43.18,55.47
  Bottom 0.152: IC1.22 36.2,54.61 37.21,55.63 42.67,55.63 42.82,55.47 v43.18,55.47
!BG00  (via drill 0.3)
  Top 0.254: v74.68,44.5 81.08,44.5 81.99,45.41 86.56,45.41 92.25,51.11 IC13.52
  Bottom 0.152: IC1.11 30.53,33.07 51.36,33.07 62.79,44.5 v74.68,44.5
!BG20  (via drill 0.3)
  Top 0.254: v71.02,78.03 73.15,78.03 73.46,77.72 85.34,77.72 85.75,77.31 IC13.142
  Bottom 0.152: IC2.B02 41.52,78.03 v71.02,78.03
!BGACK00  (via drill 0.3)
  Top 0.254: v75.29,45.11 81.08,45.11 81.99,46.02 86.56,46.02 91.75,51.22 IC13.51
  Bottom 0.152: IC1.12 28.45,33.53 51.21,33.53 62.79,45.11 v75.29,45.11
!BR00  (via drill 0.3)
  Top 0.254: v74.68,45.72 81.08,45.72 81.99,46.63 86.56,46.63 91.25,51.33 IC13.50
  Bottom 0.152: IC1.13 26.36,33.98 51.05,33.98 62.79,45.72 v74.68,45.72
!BR20  (via drill 0.3)
  Top 0.254: v72.54,82.3 85.65,82.3 89.75,78.19 IC13.134
  Bottom 0.152: IC2.A02 43.02,82.07 72.31,82.07 v72.54,82.3
!CDIS  (via drill 0.3)
  Top 0.254: v74.68,62.48 v74.69,62.47 IC13.25
  Bottom 0.152: IC2.G02 41.49,65.3 43.66,65.3 44.27,64.69 61.04,64.69 63.02,62.71 74.45,62.71 v74.68,62.48
!DS  (via drill 0.3)
  Top 0.254: v74.68,52.73 85.34,52.73 85.75,53.14 IC13.39
  Bottom 0.152: IC2.L01 38.98,55.17 42.44,55.17 42.67,54.94 43.66,54.94 44.2,55.47 71.93,55.47 v74.68,52.73
!DSACK0  (via drill 0.3)
  Top 0.254: v75.29,59.44 78.33,59.44 79.87,60.97 IC13.28
  Bottom 0.152: IC2.H01 38.9,62.71 43.66,62.71 44.5,61.87 58.22,61.87 59.89,60.2 73,60.2 73.76,59.44 v75.29,59.44
!DSACK1  (via drill 0.3)
  Top 0.254: IC13.31 80.43,59.47 80.16,59.74 79.55,59.74 78.33,58.52 v74.68,58.52
  Bottom 0.152: IC2.H02 41.59,60.96 55.78,60.96 56.39,61.57 57.91,61.57 60.96,58.52 v74.68,58.52
!DTACK  (via drill 0.3)
  Top 0.254: v75.29,43.89 81.08,43.89 81.99,44.81 86.56,44.81 92.75,51 IC13.53
  Bottom 0.152: IC1.10 32.61,32.61 51.51,32.61 62.79,43.89 v75.29,43.89
!HLT  (via drill 0.3)
  Top 0.152: IC1.17 25.6,43.38 v25.6,56.54
  Bottom 0.152: v25.6,56.54 37.81,56.54 IC2.K01
!IDE_ACT
  Top 0.254: IDE.39 90.01,94.3 IDE_ACT.1
!IDE_R
  Top 0.254: IC11.16 67.14,92.24 IDE.25
!IDE_W
  Top 0.254: IC11.17 66.49,90.35 IDE.23
!LDS  (via drill 0.3)
  Top 0.152: IC1.8 26.52,21.44 v26.52,21.49
  Top 0.254: v75.29,42.67 81.08,42.67 81.99,43.59 86.56,43.59 94.25,51.28 IC13.56
  Bottom 0.152: v26.52,21.49 36.42,31.39 51.51,31.39 62.79,42.67 v75.29,42.67
!RESET  (via drill 0.3)
  Top 0.152: IC2.C02 41.59,73.66 41.59,72.1 v41.76,71.93 41.59,71.77 v41.59,44.45 | v85.19,74.98 85.25,75.04 IC13.143
  Bottom 0.152: IC1.18 v41.59,44.45 | v41.76,71.93 64.62,71.93 65.38,71.17 72.69,71.17 73.15,70.71 78.94,70.71 83.52,75.29 84.89,75.29 v85.19,74.98
!UDS  (via drill 0.3)
  Top 0.152: IC1.7 27.43,19.81 v27.43,21.03
  Top 0.254: v74.68,42.06 81.08,42.06 81.99,42.98 86.56,42.98 94.75,51.17 IC13.57
  Bottom 0.152: v27.43,21.03 37.19,30.79 51.51,30.79 62.79,42.06 v74.68,42.06
+3V3  (via drill 0.3, 0.6)
  Top 0.152: IC6.22 78.74,8.49 v78.83,8.57 | IC6.35 84.16,8.49 v83.91,8.73 | IC6.7 78.78,15.99 v78.83,16.03 | IC6.50 83.96,15.99 v83.91,16.03 | IC7.50 83.96,32.02 v83.91,32.07 | IC7.7 78.78,32.02 v78.83,32.07 | IC7.22 78.74,24.52 v78.83,24.61 | IC7.35 84,24.52 v83.91,24.61
  Top 0.254: IC13.37 84.75,56.37 v84.73,56.39 | IC13.42 87.25,56.31 v87.17,56.39 | IC13.55 93.75,56.26 v93.88,56.39 | IC13.73 102.74,56.97 v102.72,57 | IC13.84 v102.73,62.47 v102.72,62.48 | IC13.109 102.25,75.13 v102.11,74.98 | IC13.1 83.92,74.47 v84.12,74.68 | IC13.141 v86.25,74.98 v86.26,74.98 | IC13.8 84.08,70.97 v84.12,71.02 | IC13.127 93.25,75 v93.27,74.98
  Top 0.305: v88.55,21.11 88.6,21.16 IC8.1 | IC8.3 90.2,21.18 v90.14,21.11 | IC8.9 95,21.37 v94.74,21.11 | IC8.14 99,20.94 v99.03,20.91 | IC8.49 92.6,35.32 v92.84,35.56 | IC8.43 97.4,35.54 v97.38,35.56 | v88.6,5.12 IC9.1 | v90.2,5.11 IC9.3 | v94.74,5.08 95,5.34 IC9.9 | v99.03,5.08 99,5.11 IC9.14 | v109.35,4.92 109.4,4.97 IC9.27 | IC9.49 92.6,19.13 v92.84,19.37 | IC9.43 97.4,19.33 v97.44,19.37 | IC8.27 109.4,21.14 v109.59,20.95
  Top 0.406: R14.2 114.34,33.95 v114.3,33.98 | SJ1.1 v117.65,6.4
  Top 1.016: IC5.2 IC5.4
  Bottom 0.152: v78.83,8.57 79.86,8.57 C27.1 | v83.91,8.73 82.88,8.73 C26.1 | v78.83,16.03 79.86,16.03 C24.1 | v83.91,16.03 82.88,16.03 C25.1 | v83.91,32.07 82.88,32.07 C29.1 | v78.83,32.07 79.86,32.07 C28.1 | v78.83,24.61 79.86,24.61 C30.1 | v83.91,24.61 82.88,24.61 C31.1 | C23.1 109.59,22.09
  Bottom 0.254: v84.73,56.39 84.73,57.19 C53.2 | v87.17,56.39 87.17,56.92 C51.2 | v93.88,56.39 93.88,57.43 C54.2 | v102.72,57 102.38,57 C55.2 | v102.72,62.48 101.98,62.48 C52.2 | v102.11,74.98 102.11,74.25 C49.2 | v84.12,74.68 84.46,74.68 C50.2 | v86.26,74.98 86.26,74.49 C46.2 | v84.12,71.02 84.62,71.02 C47.2 | v93.27,74.98 93.27,74.16 C48.2
  Bottom 0.305: C19.1 v88.55,21.11 | v90.14,21.11 90.14,22.09 C22.1 | v94.74,21.11 94.74,22.07 C20.1 | v99.03,20.91 99.03,22.04 C21.1 | v92.84,35.56 92.84,34.48 C17.1 | 97.28,34.42 C18.1 97.38,34.42 v97.38,35.56 | C34.1 88.58,5.14 v88.6,5.12 | C35.1 v90.19,5.12 v90.2,5.11 | C36.1 94.67,5.16 v94.74,5.08 | C37.1 99.1,5.15 v99.03,5.08 | C38.1 109.03,5.23 v109.35,4.92 | v92.84,19.37 92.84,18.45 C32.1 | v97.44,19.37 97.44,18.47 C33.1 | 109.59,22.09 v109.59,20.95
  other vias: 71.32,3.05 70.1,3.05 70.1,1.83 71.32,1.83 68.88,1.83 67.67,1.83 67.36,7.92
  pour Route15: 65.09,1.09 118.85,1.09 118.85,78.58 77.15,78.58 77.15,38.72 65.09,38.72
  pour Top: 61.26,6.1 63.09,6.1 63.09,8.53 67.67,8.53 69.8,6.4 71.93,6.4 71.93,0.61 63.09,0.61 63.09,3.66 61.26,3.66
+5V  (via drill 0.3, 0.6)
  Top 0.254: v45.11,90.53 45.28,90.36 C41.1 45.49,89.68 IC10.20 | IC15.20 36.48,89.68 C42.1 36.5,89.81 v36.5,90.75 | v62.87,90.37 C45.1 63.09,89.52 IC11.20 | IC11.1 63.01,83.52 v62.64,83.9 | R1.2 96.42,95.91 v96.39,95.94 | R2.1 85,89.96 v85.04,89.92 | R21.1 v106.98,76.2 | v106.98,85.95 R16.1 | R20.1 v106.98,81.08
  Top 0.305: v28.64,11.43 28.72,11.51 C12.1 30.03,11.86 IC3.42 | v28.57,17.46 28.65,17.39 C11.1 29.72,17.36 IC3.31 | IC3.7 40.37,11.86 v40.43,11.8 | IC3.18 37.27,17.36 v37.17,17.46 | IC4.31 52.01,17.36 v52.38,16.99 | IC4.42 v52.18,11.86 | v52.18,11.86 | IC4.18 57.26,17.36 v56.99,17.62 | IC4.7 57.2,11.86 v56.99,12.06
  Top 0.406: 120.7,11.4 R13.2 119.79,11.75 | 119.79,11.75 119.02,11.75 R12.2 | v121.61,9.45 SJ1.3 119.79,9.63 119.79,11.75
  Top 0.61: C3.1 58.42,46.04 58.42,46.2 | 72.12,69.53 72.12,69.66 C4.1 | 55.56,82.84 55.53,82.84 C5.1 | C40.1 5,92.47 IC12.32
  Top 0.813: IC1.14 25.13,34.29 25.13,34.41 C2.1 27.24,35.38 C56.1 | 3.86,39.37 IC1.49 | IC2.D01 36.43,72.07 36.43,72.2 C6.1 | IC2.B07 53.34,77.79 54.61,79.06 54.61,81.6 55.56,82.55 55.56,82.84 | 72.12,69.53 IC2.E13 | 58.42,45.99 58.42,46.2 IC2.N09 | 3.86,39.37 3.86,39.24 C1.1 | F1.2 62.62,83.88 v62.64,83.9 | v57.07,3.35 57.12,3.4 C15.1 59.78,2.6 IC5.3 | C57.1 3.91,39.32 3.86,39.37
  Bottom 0.254: v106.98,76.2 v106.98,81.08
  Bottom 0.305: C9.1 40.96,11.27 v40.43,11.8 | v37.17,17.46 38.83,17.46 C10.1 | v52.38,16.99 53.27,16.99 C13.1 | C14.1 52.32,11.99 v52.18,11.86 | C8.1 55.96,17.62 v56.99,17.62 | C7.1 56.91,11.99 v56.99,12.06
  pour Route15 (isolate 0.254, rank 2): 0,0 124.36,0 124.36,90.83 121.01,90.83 121.01,99.06 0,99.06
A0  (via drill 0.3)
  Top 0.152: IC2.B03 43.18,75.62 v43.2,75.59
  Top 0.254: IC13.4 81.33,72.97 79.93,74.37 v75.29,74.37
  Bottom 0.152: v43.2,75.59 43.74,75.59 43.97,75.82 72.62,75.82 74.07,74.37 v75.29,74.37
A1  (via drill 0.3)
  Top 0.152: IC12.12 17.07,85.48 17.07,71.32 v17.37,71.02 | v43.6,72.87 44.04,73.32 44.04,78.83 IC2.A03
  Top 0.254: v73.15,81.69 85.65,81.69 89.25,78.08 IC13.135
  Bottom 0.152: v43.6,72.87 37.31,72.87 36.83,72.39 IC1.29 23.01,72.39 21.64,71.02 v17.37,71.02 | IC2.A03 45.25,81.76 71.55,81.76 71.63,81.69 v73.15,81.69
A2  (via drill 0.3)
  Top 0.152: v64.45,74.65 64.45,72.71 65.09,72.07 IC2.D12 67.04,73.08 72.62,73.08 73.46,72.24 73.46,71.02 74.68,69.8 | IC12.11 15.56,74.05 v15.85,73.76
  Top 0.254: IC13.12 76.8,68.97 75.97,69.8 74.68,69.8
  Bottom 0.152: v15.85,73.76 21.64,73.76 22.86,74.98 24.08,74.98 IC1.30 36.83,74.93 37.34,75.44 42.22,75.44 42.67,74.98 43.89,74.98 44.35,75.44 63.66,75.44 63.91,75.19 v64.45,74.65
A3  (via drill 0.3)
  Top 0.152: v67.63,79.02 67.63,74.93 67.94,74.61 IC2.C13 | IC12.10 14.17,85.84 14.17,83.97 13.72,83.52 v13.72,76.2
  Top 0.254: IC13.6 81.11,71.97 79.93,73.15 v75.29,73.15
  Bottom 0.152: v13.72,76.2 21.64,76.2 22.91,77.47 IC1.31 36.83,77.47 37.77,78.41 66.83,78.41 67.44,79.02 v67.63,79.02 | IC2.C13 72.61,74.61 74.07,73.15 v75.29,73.15
A4  (via drill 0.3)
  Top 0.152: v66.99,82.63 66.99,75.56 IC2.C12 | IC12.9 13.02,78.73 v13.11,78.64
  Top 0.254: IC13.5 81.22,72.47 79.93,73.76 v74.68,73.76
  Bottom 0.152: v13.11,78.64 21.64,78.64 23.01,80.01 IC1.32 24.18,80.01 26.8,82.63 v66.99,82.63 | IC2.C12 66.86,75.44 72.39,75.44 74.07,73.76 v74.68,73.76
A5  (via drill 0.3)
  Top 0.152: v69.53,82.65 69.53,78.11 IC2.B13 72.81,77.15 74.37,75.59 75.29,75.59 | IC12.8 10.48,86.75 11.58,85.65 v11.58,80.01
  Top 0.254: IC13.2 81.55,73.97 79.93,75.59 75.29,75.59
  Bottom 0.152: IC1.33 v11.58,80.01 21.91,80.01 24.88,82.98 66.29,82.98 66.52,83.21 69.19,83.21 69.53,82.87 v69.53,82.65
A6  (via drill 0.3)
  Top 0.152: IC12.7 10.48,77.58 v10.36,77.47
  Top 0.254: v72.54,78.64 85.65,78.64 86.75,77.53 IC13.140
  Bottom 0.152: IC1.34 v10.36,77.47 21.59,77.47 22.99,78.87 66.53,78.87 66.53,78.88 67.36,79.7 68.57,79.7 IC2.A13 68.59,79.7 70.18,79.7 71.25,78.64 v72.54,78.64
A7  (via drill 0.3)
  Top 0.152: IC12.6 7.94,86.88 6.71,85.65 v6.71,74.93
  Top 0.254: IC13.3 81.44,73.47 79.93,74.98 v74.68,74.98
  Bottom 0.152: IC1.35 v6.71,74.93 21.59,74.93 22.86,76.2 65.09,76.2 IC2.B12 66.1,77.15 66.98,76.28 72.77,76.28 74.07,74.98 v74.68,74.98
A8  (via drill 0.3)
  Top 0.152: IC2.A12 65.01,78.66 v65.01,73.43 72.87,73.43 74.07,72.24 74.07,71.02 74.68,70.41 | IC12.5 7.94,72.71 v7.62,72.39
  Top 0.254: 74.68,70.41 75.97,70.41 76.91,69.47 IC13.11
  Bottom 0.152: IC1.36 v7.62,72.39 21.59,72.39 22.63,73.43 v65.01,73.43
A9  (via drill 0.3)
  Top 0.152: v62.55,70.51 62.55,78.74 IC2.A11 | IC12.27 9.45,96.13 9.45,70.71 10.06,70.1 v10.06,69.85
  Top 0.254: IC13.13 76.61,68.47 75.89,69.19 v75.29,69.19
  Bottom 0.152: IC1.37 v10.06,69.85 21.59,69.85 22.86,71.12 61.94,71.12 v62.55,70.51 65.02,70.51 65.3,70.79 71.25,70.79 72.85,69.19 v75.29,69.19
A10  (via drill 0.3)
  Top 0.152: v63.5,68.58 IC2.B11 | IC12.26 14.17,93.46 14.17,86.41 14.48,86.11 14.48,83.36 14.33,83.21 v14.33,67.31
  Top 0.254: IC13.16 76.13,66.97 75.74,67.36 v74.68,67.36
  Bottom 0.152: IC1.38 v14.33,67.31 21.59,67.31 22.55,68.28 63.17,68.28 63.48,68.58 v63.5,68.58 63.55,68.58 63.86,68.28 71.32,68.28 72.24,67.36 v74.68,67.36
A11  (via drill 0.3)
  Top 0.152: IC12.23 16.76,95.95 16.76,86.56 17.68,85.65 18.9,85.65 19.51,85.04 v19.51,64.77 | v60.35,53.34 60.01,53.68 v60.01,66.27 60.01,78.74 IC2.A10
  Top 0.254: v75.29,50.9 87.17,50.9 87.75,51.48 IC13.43
  Bottom 0.152: IC1.39 v19.51,64.77 21.27,64.77 22.64,66.14 44.5,66.14 44.81,66.45 45.72,66.45 45.9,66.27 v60.01,66.27 | v60.35,53.34 60.66,53.03 72.24,53.03 74.37,50.9 v75.29,50.9
A12  (via drill 0.3)
  Top 0.152: IC12.25 14.48,95.69 14.48,86.56 15.54,85.5 16.31,85.5 16.61,85.19 v16.61,62.23 | v61.27,54.25 60.96,54.56 v60.96,63.5 IC2.B10
  Top 0.254: v74.68,51.51 85.95,51.51 86.75,52.31 IC13.41
  Bottom 0.152: IC1.40 v16.61,62.23 21.59,62.23 22.86,63.5 v60.96,63.5 | v61.27,54.25 62.18,53.34 72.54,53.34 74.37,51.51 v74.68,51.51
A13  (via drill 0.3)
  Top 0.152: IC12.4 5.4,59.78 v5.49,59.69 | v57.61,60.96 57.47,61.1 57.47,78.74 IC2.A09
  Top 0.254: v73.15,79.25 85.65,79.25 87.25,77.64 IC13.139
  Bottom 0.152: IC1.41 v5.49,59.69 21.59,59.69 22.86,60.96 37.19,60.96 37.49,60.66 57.3,60.66 v57.61,60.96 | IC2.A09 59.27,80.54 70.18,80.54 71.48,79.25 v73.15,79.25
A14  (via drill 0.3)
  Top 0.152: IC12.28 11.58,93.51 11.58,86.56 11.89,86.26 11.89,83.21 12.19,82.91 v12.19,57.15 | v59.74,51.21 59.74,51.82 58.42,53.14 v58.42,58.42 IC2.B09
  Top 0.254: v75.29,49.68 87.17,49.68 88.75,51.26 IC13.45
  Bottom 0.152: IC1.42 v12.19,57.15 21.59,57.15 22.86,58.42 v58.42,58.42 | v59.74,51.21 60.05,50.9 72.54,50.9 73.76,49.68 v75.29,49.68
A15  (via drill 0.3)
  Top 0.152: v54.29,56.03 54.29,77.47 55.88,79.06 IC2.A08 | IC12.29 6.55,95.77 6.55,86.41 5.94,85.8 5.94,71.32 6.1,71.17 v6.1,54.61
  Top 0.254: v72.54,79.86 85.65,79.86 87.75,77.75 IC13.138
  Bottom 0.152: IC1.43 v6.1,54.61 21.59,54.61 22.86,55.88 36.52,55.88 36.65,56.01 47.62,56.01 47.85,55.78 50.9,55.78 51.13,56.01 54.27,56.01 v54.29,56.03 | IC2.A08 57.04,80.85 70.64,80.85 71.63,79.86 v72.54,79.86
A16  (via drill 0.3)
  Top 0.152: IC2.B08 54.93,76.2 54.93,73.39 55.47,72.85 v55.47,72.47 54.93,71.92 v54.93,53.34 | IC12.3 9.14,88.33 v9.14,52.07
  Top 0.254: IC13.10 77.02,69.97 75.67,71.32 v74.68,71.32
  Bottom 0.152: IC1.44 v9.14,52.07 21.59,52.07 22.55,53.03 54.56,53.03 54.86,53.34 v54.93,53.34 | v55.47,72.47 65.3,72.47 65.91,73.08 71.4,73.08 73.15,71.32 v74.68,71.32
A17  (via drill 0.3)
  Top 0.152: IC12.2 4.27,88.41 v4.27,49.53 | v52.15,50.72 52.05,50.83 52.05,78.45 IC2.A06
  Top 0.254: v73.15,80.47 85.65,80.47 88.25,77.86 IC13.137
  Bottom 0.152: IC1.45 v4.27,49.53 21.59,49.53 22.86,50.8 36.98,50.8 37.19,50.6 52.03,50.6 v52.15,50.72 | IC2.A06 52.26,81.15 70.94,81.15 71.63,80.47 v73.15,80.47
A18  (via drill 0.3)
  Top 0.152: IC2.B06 49.91,76.26 49.91,57.84 49.37,57.3 49.37,48.42 v49.53,48.26
  Top 0.254: v75.29,47.85 86.56,47.85 90.25,51.54 IC13.48
  Bottom 0.152: IC1.46 21.59,46.99 22.86,48.26 v49.53,48.26 53.67,48.26 55.47,50.06 72.01,50.06 74.22,47.85 v75.29,47.85
A19  (via drill 0.3)
  Top 0.152: v49.85,45.72 49.85,47.62 50.16,47.94 50.16,48.74 49.85,49.05 49.85,52.26 49.68,52.43 49.68,54.86 49.99,55.17 49.99,56.69 50.75,57.45 v50.75,70.26 50.8,70.31 IC2.C06
  Top 0.254: IC13.14 76.43,67.97 75.82,68.58 v74.68,68.58
  Bottom 0.152: IC1.47 21.59,44.45 22.86,45.72 v49.85,45.72 | v50.75,70.26 50.83,70.33 61.34,70.33 61.87,69.8 64.92,69.8 65.53,70.41 71.02,70.41 72.85,68.58 v74.68,68.58
A20  (via drill 0.3)
  Top 0.152: IC2.A05 47.15,78.58 47.15,73.67 46.63,73.15 46.63,72.01 47.15,71.5 47.15,43.5 v46.83,43.18
  Top 0.254: v72.54,81.08 85.65,81.08 88.75,77.97 IC13.136
  Bottom 0.152: IC1.48 21.59,41.91 22.86,43.18 v46.83,43.18 | IC2.A05 50.02,81.46 71.25,81.46 71.63,81.08 v72.54,81.08
A21  (via drill 0.3)
  Top 0.152: v47.31,38.1 47.47,38.26 47.47,52.65 47.55,52.73 47.55,72.54 v47.62,72.62 47.62,76.52 IC2.B05
  Top 0.254: IC13.9 77.13,70.47 75.67,71.93 v75.29,71.93
  Bottom 0.152: IC1.50 21.59,36.83 22.86,38.1 v47.31,38.1 | v47.62,72.62 47.85,72.85 54.79,72.85 55.02,73.08 55.78,73.08 56.01,72.85 65.23,72.85 65.84,73.46 71.93,73.46 73.46,71.93 v75.29,71.93
A22  (via drill 0.3)
  Top 0.152: v44.13,35.56 v44.13,35.57 44.5,35.94 44.5,49.76 44.04,50.22 44.04,67.44 v44.27,67.67 44.49,67.89 44.49,78.47 IC2.A04
  Top 0.254: IC13.17 76.02,66.47 75.74,66.75 v75.29,66.75
  Bottom 0.152: IC1.51 21.59,34.29 22.86,35.56 v44.13,35.56 | v44.27,67.67 44.42,67.82 70.87,67.82 71.93,66.75 v75.29,66.75
A23  (via drill 0.3)
  Top 0.152: IC2.B04 44.93,76.36 44.93,66.1 v45.19,65.84 44.5,65.15 44.5,50.29 44.88,49.91 44.88,34.5 v44.93,34.54
  Top 0.254: v74.68,64.92 75.59,64.92 76.04,64.47 IC13.21
  Bottom 0.152: IC1.52 21.59,31.75 22.86,33.02 24.64,33.02 26.16,34.54 v44.93,34.54 | v45.19,65.84 45.49,65.53 61.49,65.53 61.72,65.76 70.41,65.76 71.25,64.92 v74.68,64.92
ABUS_DIR  (via drill 0.3)
  Top 0.152: 56.94,8.56 57.24,8.86 IC4.1 | IC4.24 57.23,20.36 | IC3.24 37.31,20.36 36.41,19.45 36.41,12.29 37.8,10.89 37.8,9.02 37.97,8.86 IC3.1 39.37,8.86 39.98,8.24 46.52,8.24 46.83,7.94 56.32,7.94 56.94,8.56 | 56.94,8.56 56.85,8.56 56.36,9.05 56.36,19.48 57.23,20.36 | 57.23,20.36 57.23,31.39 | 57.23,31.39 | 57.23,31.39 v57.23,32.84 | v57.23,32.84
  Top 0.254: v74.68,39.62 81.08,39.62 81.99,40.54 86.56,40.54 96.75,50.73 IC13.61
  Bottom 0.152: v57.23,32.84 57.23,34.06 62.79,39.62 v74.68,39.62
ABUS_L  (via drill 0.3)
  Top 0.152: IC4.48 48.86,8.86 48.34,8.34 47.07,8.34 46.83,8.57 46.83,9.21 46.98,9.36 46.98,19.4 47.94,20.36 IC4.25 54.19,20.36 56.39,22.55 v56.39,33.53
  Top 0.254: v75.29,40.23 81.08,40.23 81.99,41.15 86.56,41.15 96.25,50.84 IC13.60
  Bottom 0.152: v56.39,33.53 56.39,33.83 62.79,40.23 v75.29,40.23
ABUS_U  (via drill 0.3)
  Top 0.152: IC3.48 28.35,8.86 28.04,9.16 28.04,20.12 28.62,20.69 30.03,20.69 30.36,20.36 IC3.25 32.55,20.36 v33.22,21.03
  Top 0.254: v74.68,40.84 81.08,40.84 81.99,41.76 86.56,41.76 95.75,50.95 IC13.59
  Bottom 0.152: v33.22,21.03 41.76,29.57 51.51,29.57 62.79,40.84 v74.68,40.84
ARAM_0
  Top 0.152: IC9.23 106.2,16.6 106.6,17 106.6,20.6 106.2,21 IC8.23 106.2,31.8 106.6,32.2 106.6,37.11 107.29,37.8 108.81,37.8 109.28,38.26 RN2.P$2
ARAM_1
  Top 0.152: IC9.24 107,16.6 107.4,17 107.4,20.8 107,21.2 IC8.24 107,31.4 107.4,31.8 107.4,36.69 107.9,37.19 110.64,37.19 110.98,37.52 RN2.P$4
ARAM_2
  Top 0.152: IC9.25 107.8,16.6 108.2,17 108.2,21 107.8,21.4 IC8.25 107.8,31 108.2,31.4 108.2,36.27 108.51,36.58 112.47,36.58 112.77,36.87 RN1.P$2
ARAM_3
  Top 0.152: IC9.26 108.6,16.6 109,17 109,21.2 108.6,21.6 IC8.26 108.6,30.6 109,31 109,35.85 109.12,35.97 114,35.97 114.47,36.44 RN1.P$4
ARAM_4
  Top 0.152: IC9.29 108.6,21.1 108.2,21.5 108.2,30.8 108.6,31.2 IC8.29 108.6,36.06 108.81,36.27 113.08,36.27 113.57,36.76 RN1.P$3
ARAM_5
  Top 0.152: IC9.30 107.8,20.9 107.4,21.3 107.4,31.2 107.8,31.6 IC8.30 107.8,36.48 108.2,36.88 111.25,36.88 111.87,37.5 RN1.P$1
ARAM_6
  Top 0.152: IC9.31 107,20.7 106.6,21.1 106.6,31.6 107,32 IC8.31 107,36.9 107.59,37.49 109.73,37.49 110.08,37.84 RN2.P$3
ARAM_7
  Top 0.152: IC9.32 106.2,20.5 105.8,20.9 105.8,32 106.2,32.4 IC8.32 106.2,37.31 106.98,38.1 107.9,38.1 108.38,38.58 RN2.P$1
ARAM_8
  Top 0.152: IC9.33 105.4,20.3 105,20.7 105,32.3 105.4,32.7 IC8.33 105.4,37.73 106.58,38.92 RN3.P$3
ARAM_9
  Top 0.152: IC9.34 104.6,20.1 104.2,20.5 104.2,32.5 104.6,32.9 IC8.34 104.6,38.15 104.89,38.44 RN3.P$1
ARAM_10
  Top 0.152: IC9.22 105.4,16.6 105.8,17 105.8,20.4 105.4,20.8 IC8.22 105.4,32.2 105.8,32.6 105.8,37.52 106.68,38.41 107.29,38.41 107.48,38.6 RN3.P$4
ARAM_11
  Top 0.152: IC9.35 103.8,19.9 103.4,20.3 103.4,32.8 103.8,33.2 IC8.35 103.8,35.8 103.09,36.51 RN4.P$3
ARAM_12
  Top 0.152: IC9.36 103,19.5 102.6,19.9 102.6,32.2 103,32.6 IC8.36 103,35.99 102.29,36.7 RN4.P$2
AUTOBOOT
  Top 0.254: JP1.2 110.12,86.11 R16.2 109.73,85.71 109.73,85.04 109.42,84.73 104.24,84.73 98.75,79.25 IC13.116
AVEC  (via drill 0.3)
  Top 0.254: v75.29,60.66 78.33,60.66 79.65,61.97 IC13.26
  Bottom 0.152: IC2.G03 43.32,64.31 60.96,64.31 61.87,63.4 61.87,62.18 63.02,61.04 74.91,61.04 v75.29,60.66
BA0
  Top 0.152: IC9.20 103.8,16.8 104.2,17.2 104.2,20 103.8,20.4 IC8.20 103.8,32.6 104.2,33 104.2,36.01 103.99,36.22 RN4.P$4
BA1
  Top 0.152: IC9.21 104.6,16.6 105,17 105,20.2 104.6,20.6 IC8.21 104.6,32.4 105,32.8 105,37.94 105.8,38.74 105.8,39.55 RN3.P$2
C_ARAM_0
  Top 0.254: RN2.P$7 109.28,46.41 114.15,51.28 114.15,61.11 106.79,68.47 IC13.96
C_ARAM_1
  Top 0.254: RN2.P$5 110.98,46.82 115.06,50.9 115.06,61.42 107.01,69.47 IC13.98
C_ARAM_2
  Top 0.254: RN1.P$7 112.77,47.24 115.98,50.44 115.98,61.72 106.73,70.97 IC13.101
C_ARAM_3
  Top 0.254: RN1.P$5 114.47,47.72 116.97,50.22 116.97,62.1 107.1,71.97 IC13.103
C_ARAM_4
  Top 0.254: RN1.P$6 113.57,47.43 116.43,50.29 116.43,61.95 106.91,71.47 IC13.102
C_ARAM_5
  Top 0.254: RN1.P$8 111.87,47.02 115.52,50.67 115.52,61.57 106.62,70.47 IC13.100
C_ARAM_6
  Top 0.254: RN2.P$6 110.08,46.6 114.61,51.13 114.61,61.27 106.9,68.97 IC13.97
C_ARAM_7
  Top 0.254: RN2.P$8 108.38,46.12 113.69,51.44 113.69,60.96 106.68,67.97 IC13.95
C_ARAM_8
  Top 0.254: RN3.P$6 106.58,45.7 112.78,51.89 112.78,60.66 106.46,66.97 IC13.93
C_ARAM_9
  Top 0.254: RN3.P$8 104.89,45.3 111.86,52.27 111.86,60.35 106.24,65.97 IC13.91
C_ARAM_10
  Top 0.254: RN3.P$5 107.48,45.91 113.23,51.66 113.23,60.81 106.57,67.47 IC13.94
C_ARAM_11
  Top 0.254: RN4.P$6 103.09,44.8 110.95,52.65 110.95,60.05 107.02,63.97 IC13.87
C_ARAM_12
  Top 0.254: RN4.P$7 102.29,44.69 110.34,52.73 110.49,52.88 110.49,59.89 106.91,63.47 IC13.86
C_BA0
  Top 0.254: RN4.P$5 103.99,45.09 111.4,52.5 111.4,60.2 107.13,64.47 IC13.88
C_BA1
  Top 0.254: RN3.P$7 105.78,45.51 112.32,52.05 112.32,60.5 106.35,66.47 IC13.92
C_CAS
  Top 0.254: IC13.82 107.08,61.47 109.12,59.44 109.12,53.34 99.6,43.82 RN5.P$6
C_CLK20
  Top 0.254: IC13.7 79.94,71.47 R17.1
C_CLK_RAM
  Top 0.254: RN5.P$7 98.8,43.63 108.66,53.49 108.66,59.28 106.97,60.97 IC13.81
C_CLKEN
  Top 0.254: RN5.P$5 100.5,44.11 109.58,53.19 109.58,59.59 107.19,61.97 IC13.83
C_IDE_A0
  Top 0.254: IC11.7 68.44,84.6 69.49,85.65 84.12,85.65 84.73,85.04 85.04,84.73 91.25,78.52 IC13.131
C_IDE_A1
  Top 0.254: IC11.5 67.14,85.13 68.89,86.87 84.12,86.87 92.25,78.74 IC13.129
C_IDE_A2
  Top 0.254: IC11.6 67.79,84.86 69.19,86.26 84.12,86.26 91.75,78.63 IC13.130
C_IDE_BUFFER_DIR  (via drill 0.3)
  Top 0.152: IC10.1 46.82,84.39 v46.48,84.73 | IC15.1 37.02,83.68 v36.96,83.74
  Top 0.254: IC13.124 94.75,78.68 86.87,86.56 v86.87,87.17
  Bottom 0.152: v36.96,83.74 39.7,83.74 40.69,84.73 v46.48,84.73 62.18,84.73 66.14,88.7 85.95,88.7 86.87,87.78 v86.87,87.17
C_IDE_CS0
  Top 0.254: IC11.9 69.74,84.07 70.1,84.43 84.12,84.43 90.25,78.3 IC13.133
C_IDE_CS1
  Top 0.254: IC11.8 69.09,84.33 69.8,85.04 84.12,85.04 90.75,78.41 IC13.132
C_IDE_R
  Top 0.254: IC11.4 66.49,85.39 68.58,87.48 84.12,87.48 92.75,78.85 IC13.128
C_IDE_RESET
  Top 0.254: IC11.2 65.19,85.01 68.28,88.09 84.12,88.09 93.75,78.46 IC13.126
C_LDQ0
  Top 0.254: IC13.79 106.75,59.97 107.75,58.98 107.75,53.95 97.01,43.21 RN6.P$1
C_LDQ1
  Top 0.254: RN6.P$2 96.11,43 107.29,54.18 107.29,58.83 106.64,59.47 IC13.78
C_RAS
  Top 0.254: RN4.P$8 101.39,44.39 110.03,53.03 110.03,59.74 106.8,62.97 IC13.85
C_UDQ0
  Top 0.254: RN6.P$3 95.31,42.88 106.83,54.41 106.83,58.67 106.53,58.97 IC13.77
C_UDQ1
  Top 0.254: IC13.76 106.12,58.47 106.38,58.22 106.38,54.56 105.31,53.49 105.16,53.34 94.41,42.59 RN6.P$4
C_WE
  Top 0.254: RN5.P$8 97.9,43.34 108.2,53.65 108.2,59.13 106.86,60.47 IC13.80
CAS
  Top 0.152: IC9.17 101.4,16.8 101.8,17.2 101.8,19.2 101.4,19.6 IC8.17 101.4,32.6 101.8,33 101.8,35.82 99.6,38.02 RN5.P$3
CLK7  (via drill 0.3)
  Top 0.254: v83.52,55.47 83.52,56.08 84.12,56.69 84.12,59.44 83.59,59.97 IC13.30
  Bottom 0.152: IC1.15 53.29,36.83 62.79,46.33 75.29,46.33
  Bottom 0.254: 75.29,46.33 81.08,46.33 83.52,48.77 v83.52,55.47
CLK20  (via drill 0.3)
  Top 0.254: v74.68,72.54 75.67,72.54 76.89,71.32 R17.2
  Bottom 0.152: IC2.C01 38.95,73.76 64.31,73.76 64.62,74.07 65.23,74.07 65.53,73.76 72.54,73.76 73.76,72.54 v74.68,72.54
CLK_EXT  (via drill 0.3)
  Top 0.254: R15.1 119.81,26.54 119.79,26.52 v119.79,49.99 | IC13.32 v79.94,58.97 v79.93,58.98
  Bottom 0.254: v79.93,58.98 79.93,58.14 80.16,57.91 82.07,57.91 84.35,55.63 84.35,53.26 84.89,52.73 100.89,52.73 102.11,51.51 118.26,51.51 v119.79,49.99
CLK_RAM
  Top 0.152: IC9.38 101.4,19.1 101,19.5 101,32.7 101.4,33.1 IC8.38 101.4,35.76 99.52,37.64 99.21,37.64 98.8,38.06 RN5.P$2
CLKEN
  Top 0.152: IC9.37 102.2,19.3 101.8,19.7 101.8,32.5 102.2,32.9 IC8.37 102.2,35.87 100.5,37.58 RN5.P$4
D0
  Top 0.152: IC4.2 59.26,9.36 73.98,24.07 73.98,33.22 | 73.98,33.22 73.98,59.85 69.37,64.45 IC2.G13 | IC7.5 75.49,33.02 75.29,33.22 73.98,33.22
D1  (via drill 0.3)
  Top 0.152: IC4.3 59.01,9.86 73.34,24.19 v73.34,32.61 73.34,59.53 69.53,63.34 64.93,63.34 IC2.H11 | IC7.6 75.08,32.52 v74.98,32.61
  Bottom 0.152: v74.98,32.61 v73.34,32.61
D2  (via drill 0.3)
  Top 0.152: IC4.5 58.97,10.86 72.71,24.59 v72.71,32.16 72.71,59.37 69.37,62.71 66.83,62.71 IC2.H12 | IC7.8 75.77,31.52 75.44,31.85 v74.52,31.85
  Bottom 0.152: v74.52,31.85 73.01,31.85 v72.71,32.16
D3  (via drill 0.3)
  Top 0.152: IC4.6 58.84,11.36 72.07,24.59 v72.07,31.55 72.07,58.42 IC2.H13 | IC7.9 75.36,31.02 v75.13,31.24
  Bottom 0.152: v75.13,31.24 72.38,31.24 v72.07,31.55
D4  (via drill 0.3)
  Top 0.152: IC4.8 59.08,12.36 71.44,24.71 v71.44,30.94 71.44,55.24 68.9,57.78 67.63,57.78 IC2.J12 | IC7.10 75.55,30.52 75.44,30.63 v74.52,30.63
  Bottom 0.152: v74.52,30.63 71.74,30.63 v71.44,30.94
D5  (via drill 0.3)
  Top 0.152: IC4.9 58.99,12.86 70.64,24.51 70.64,29.65 70.87,29.87 v70.87,30.33 70.87,31.37 70.64,31.59 70.64,54.77 IC2.K13 | IC7.12 76.4,29.52 75.89,30.02 v75.13,30.02
  Bottom 0.152: v75.13,30.02 71.17,30.02 v70.87,30.33
D6  (via drill 0.3)
  Top 0.152: IC4.11 59.21,13.86 70.17,24.81 v70.17,30.02 70.17,53.98 68.9,55.24 66.99,55.24 IC2.L12 | IC7.13 76.14,29.02 75.74,29.41 v74.52,29.41
  Bottom 0.152: v74.52,29.41 70.78,29.41 v70.17,30.02
D7  (via drill 0.3)
  Top 0.152: IC4.12 59.08,14.36 69.53,24.81 v69.53,29.41 69.53,53.34 IC2.L13 | IC7.14 75.72,28.52 v75.59,28.65
  Bottom 0.152: v75.59,28.65 75.44,28.8 70.14,28.8 v69.53,29.41
D8  (via drill 0.3)
  Top 0.152: IC4.14 58.91,15.36 67.63,24.07 v67.63,30.02 67.63,50.8 IC2.M13 | IC7.15 75.16,28.02 v74.98,28.19
  Bottom 0.152: v74.98,28.19 69.46,28.19 v67.63,30.02
D9  (via drill 0.3)
  Top 0.152: IC2.M12 66.83,50.96 v66.83,29.72 66.83,24.25 58.93,16.36 IC4.16 | IC7.16 74.59,27.52 v74.52,27.58
  Bottom 0.152: v74.52,27.58 68.97,27.58 v66.83,29.72
D10  (via drill 0.3)
  Top 0.152: IC4.13 58.97,14.86 68.58,24.47 v68.58,27.13 IC2.N13 | IC7.17 74.72,27.02 v74.52,26.82
  Bottom 0.152: v74.52,26.82 68.89,26.82 v68.58,27.13
D11  (via drill 0.3)
  Top 0.152: IC4.17 58.81,16.86 66.04,24.09 v66.04,28.8 IC2.N12 | IC7.19 75.17,26.02 v75.13,26.06
  Bottom 0.152: v75.13,26.06 74.98,26.21 68.63,26.21 v66.04,28.8
D12  (via drill 0.3)
  Top 0.152: IC4.19 58.85,17.86 64.45,23.46 v64.45,29.57 64.45,50.8 IC2.M11 | IC7.20 74.61,25.52 v74.52,25.6
  Bottom 0.152: v74.52,25.6 68.42,25.6 v64.45,29.57
D13  (via drill 0.3)
  Top 0.152: IC4.20 58.84,18.36 63.5,23.02 v63.5,29.72 IC2.N11 | IC7.21 74.7,25.02 v74.52,24.84
  Bottom 0.152: v74.52,24.84 68.38,24.84 v63.5,29.72
D14  (via drill 0.3)
  Top 0.152: IC2.M10 61.91,50.8 v61.91,30.48 61.91,22.38 58.88,19.36 IC4.22 | IC7.23 74.74,24.02 v74.68,24.08
  Bottom 0.152: v74.68,24.08 68.31,24.08 v61.91,30.48
D15  (via drill 0.3)
  Top 0.152: IC4.23 58.9,19.86 60.96,21.91 v60.96,30.33 IC2.N10 | IC7.24 74.27,23.52 v74.22,23.47
  Bottom 0.152: v74.22,23.47 67.82,23.47 v60.96,30.33
D16  (via drill 0.3)
  Top 0.152: IC2.N08 55.4,48.74 55.4,29.87 v55.71,29.57 55.71,26.45 53.03,23.77 50.83,23.77 46.67,19.61 46.67,10.42 45.6,9.36 IC3.2 | IC6.5 73.23,16.99 v70.56,19.66 | IC15.3 39.3,83.04 38.86,82.6 31.32,82.6 30.48,81.76 v30.48,47.55
  Bottom 0.152: v70.56,19.66 60.81,29.41 55.86,29.41 v55.71,29.57 | v30.48,47.55 54.22,47.55 IC2.N08
D17  (via drill 0.3)
  Top 0.152: IC2.L07 53.34,53.02 54.77,51.59 54.77,29.2 v54.96,29.01 54.96,26.77 52.43,24.23 50.79,24.23 46.36,19.81 46.36,10.58 45.64,9.86 IC3.3 | IC6.6 72.82,16.49 v70.41,18.9 | IC15.5 40.6,83.27 39.32,81.99 32.61,81.99 31.7,81.08 v31.7,53.95
  Bottom 0.152: v70.41,18.9 60.35,28.96 55.02,28.96 v54.96,29.01 | v31.7,53.95 37.19,53.95 37.64,53.49 52.54,53.49 IC2.L07
D18  (via drill 0.3)
  Top 0.152: IC3.5 41.04,10.86 41.23,11.05 45.43,11.05 46.05,11.67 46.05,20 50.74,24.69 52.2,24.69 54.25,26.74 v54.25,28.43 54.29,28.47 54.29,50.8 IC2.M07 | IC6.8 72.75,15.49 v69.49,18.75 | IC15.7 41.9,83.35 39.93,81.38 34.14,81.38 32.92,80.16 v32.92,51.51
  Bottom 0.152: v69.49,18.75 59.89,28.35 54.33,28.35 v54.25,28.43 | v32.92,51.51 37.19,51.51 37.8,50.9 51.21,50.9 52.06,51.75 IC2.M07
D19  (via drill 0.3)
  Top 0.152: IC2.N07 53.34,45.72 v53.34,45.11 53.34,28.02 v53.31,27.99 53.31,26.49 51.97,25.15 50.7,25.15 45.74,20.19 45.74,12.45 44.72,11.43 40.96,11.43 40.8,11.27 40.16,11.27 40.08,11.36 IC3.6 | IC6.9 72.19,14.99 v69.34,17.83 | IC15.9 43.2,83.43 40.54,80.77 35.05,80.77 34.14,79.86 v34.14,45.11
  Bottom 0.152: v69.34,17.83 59.28,27.89 53.42,27.89 v53.31,27.99 | v34.14,45.11 v53.34,45.11
D20  (via drill 0.3)
  Top 0.152: IC3.8 40.83,12.36 41.23,12.76 44.81,12.76 45.43,13.38 45.43,20.38 50.65,25.6 51.82,25.6 52.43,26.21 52.43,27.43 v52.23,27.63 v52.23,27.64 52.23,45.31 52.12,45.41 52.12,49.8 51.59,50.32 51.59,53.5 IC2.L06 | IC6.10 71.77,14.49 v68.58,17.68 | IC10.3 48.12,83.17 47.55,82.6 44.42,82.6 42.14,80.31 42.14,74.45 42.9,73.69 42.9,70.56 42.37,70.03 42.37,54.33 v42.67,54.03
  Bottom 0.152: v68.58,17.68 58.83,27.43 52.43,27.43 v52.23,27.63 | v42.67,54.03 50.53,54.03 IC2.L06
D21  (via drill 0.3)
  Top 0.152: IC3.9 40.7,12.86 41.07,13.22 44.49,13.22 45.12,13.85 45.12,20.65 50.53,26.06 51.05,26.06 51.74,26.75 v51.74,27.05 51.51,27.28 51.51,27.74 51.75,27.98 51.75,49.53 50.8,50.48 IC2.M06 49.99,52.56 49.99,54.63 50.6,55.24 v50.6,56.39 | IC6.12 71.86,13.49 v68.43,16.92 | v48.16,56.39 48.16,75.89 49.07,76.81 49.07,82.6 49.42,82.95 IC10.5
  Bottom 0.152: v68.43,16.92 58.37,26.98 51.82,26.98 v51.74,27.05 | v48.16,56.39 v50.6,56.39
D22  (via drill 0.3)
  Top 0.152: IC3.11 44.19,13.86 44.81,14.47 44.81,21.34 50.08,26.61 v50.81,26.61 v50.8,26.62 v50.8,46.25 50.8,47.85 IC2.N06 | IC6.13 71.6,12.99 v67.67,16.92 | IC10.7 50.72,83.09 51.59,82.22 51.59,79.48 52.43,78.64 52.43,51.36 53.03,50.75 53.03,50.14 52.5,49.61 52.5,46.02 v52.73,45.8
  Bottom 0.152: v67.67,16.92 58.06,26.52 50.9,26.52 v50.81,26.61 | v52.73,45.8 51.26,45.8 v50.8,46.25
D23  (via drill 0.3)
  Top 0.152: IC3.12 43.91,14.36 44.49,14.94 44.49,21.63 44.5,21.64 44.5,21.81 v48.88,26.18 48.9,26.2 48.9,42.37 v48.9,44.5 48.9,48.58 49.05,48.74 49.05,50.96 IC2.M05 | IC6.14 71.18,12.49 v67.67,16 | IC10.9 52.02,84.33 52.12,84.43 55.78,84.43 56.69,83.52 56.69,51.82 58.22,50.29 58.83,50.29 59.44,49.68 v59.44,44.5
  Bottom 0.152: v67.67,16 57.61,26.06 49,26.06 v48.88,26.18 | v59.44,44.5 v48.9,44.5
D24  (via drill 0.3)
  Top 0.152: IC3.13 43.79,14.86 44.18,15.25 44.18,21.93 46.94,24.69 v46.94,25.74 v46.95,25.75 46.95,33.67 48.26,34.99 v48.26,43.59 IC2.N05 | IC6.15 70.92,11.99 v66.9,16 | IC10.8 51.37,84.29 51.82,84.73 56.08,84.73 57,83.82 57,52.05 58.14,50.9 58.83,50.9 60.05,49.68 60.05,44.2 59.44,43.59 v59.13,43.59
  Bottom 0.152: v66.9,16 57.3,25.6 47.09,25.6 v46.95,25.75 | v59.13,43.59 v48.26,43.59
D25  (via drill 0.3)
  Top 0.152: IC3.14 43.2,15.36 43.87,16.02 43.87,22.23 46.31,24.67 v46.31,25.24 46.31,25.31 46.2,25.43 46.2,43.66 46.67,44.13 46.67,50.8 IC2.M04 v45.72,59.44 | IC6.16 70.66,11.49 v66.9,15.24 | IC10.6 50.07,82.84 49.68,82.45 49.68,76.81 48.77,75.89 v48.77,59.44
  Bottom 0.152: v66.9,15.24 57,25.15 46.41,25.15 v46.31,25.24 | v48.77,59.44 v45.72,59.44
D26  (via drill 0.3)
  Top 0.152: IC3.16 43.11,16.36 43.56,16.8 43.56,22.68 v45.68,24.8 45.72,24.84 IC2.N04 45.72,50.29 44.81,51.21 44.81,59.44 46.63,61.27 46.63,71.02 46.02,71.63 46.02,73.46 46.63,74.07 46.63,81.99 46.94,82.3 48.16,82.3 48.77,82.91 IC10.4 | IC6.17 70.4,10.99 v66.14,15.24
  Bottom 0.152: v66.14,15.24 56.69,24.69 45.8,24.69 v45.68,24.8
D27  (via drill 0.3)
  Top 0.152: IC3.17 41.27,16.86 43.25,18.84 43.25,24.69 v43.02,24.92 43.02,43.97 44.13,45.09 44.12,45.1 44.12,49.45 43.18,50.39 IC2.M03 41.99,52.95 41.99,70.94 42.37,71.32 42.37,73.46 41.76,74.07 41.76,80.47 44.2,82.91 47.17,82.91 47.47,83.21 IC10.2 | IC6.19 70.63,9.99 v66.14,14.48
  Bottom 0.152: v66.14,14.48 56.39,24.23 43.71,24.23 v43.02,24.92
D28  (via drill 0.3)
  Top 0.152: IC2.N03 43.18,44.93 42.46,44.21 v42.46,43.89 v42.46,24.38 42.94,23.91 42.94,18.98 41.81,17.86 IC3.19 | v65.38,14.33 70.22,9.49 IC6.20 78.37,9.49 78.64,9.75 79.25,9.75 79.7,10.21 79.7,37.64 81.99,39.93 | IC15.8 42.55,83.39 40.23,81.08 34.75,81.08 33.53,79.86 v33.53,43.89
  Top 0.254: IC13.64 98.25,51.62 86.56,39.93 81.99,39.93
  Bottom 0.152: v65.38,14.33 55.93,23.77 43.07,23.77 v42.46,24.38 | v33.53,43.89 v42.46,43.89
D29  (via drill 0.3)
  Top 0.152: IC2.N02 v40.64,46.33 40.64,25.34 v42.36,23.62 42.63,23.36 42.63,19.45 41.54,18.36 IC3.20 | v65.23,13.56 69.81,8.99 IC6.21 78.48,8.99 78.72,9.22 79.78,9.22 80.16,9.6 80.16,37.49 81.99,39.32 | IC15.6 41.25,83.31 39.62,81.69 33.22,81.69 32.31,80.77 v32.31,46.33
  Top 0.254: IC13.66 99.25,52.01 86.56,39.32 81.99,39.32
  Bottom 0.152: v65.23,13.56 55.47,23.32 42.67,23.32 v42.36,23.62 | v32.31,46.33 v40.64,46.33
D30  (via drill 0.3)
  Top 0.152: IC3.22 39.73,19.36 40.6,20.23 v40.6,22.07 40.6,22.16 39.2,23.57 39.2,50.32 | IC2.M02 39.2,50.32 | v64.34,13.44 69.8,7.99 IC6.23 80.3,7.99 80.54,8.23 80.54,36.73 80.54,37.19 82.07,38.71 | IC15.4 39.95,83.23 39.01,82.3 32,82.3 31.09,81.38 v31.09,50.14 | v36.5,50.14 39.03,50.14 39.2,50.32
  Top 0.254: IC13.68 100.25,52.4 86.56,38.71 82.07,38.71
  Bottom 0.152: v64.34,13.44 55.72,22.07 v40.61,22.07 v40.6,22.07 | v31.09,50.14 v36.5,50.14
D31  (via drill 0.3)
  Top 0.152: IC3.23 39.46,19.86 39.98,20.38 v39.98,21.41 39.98,21.56 38.12,23.43 38.12,49.2 IC2.N01 | v64.32,12.68 69.51,7.49 IC6.24 80.64,7.49 80.92,7.77 80.92,36.73 82.3,38.1 | IC15.2 38.65,83.15 38.41,82.91 30.79,82.91 29.87,81.99 v29.87,48.92
  Top 0.254: 82.3,38.1 86.56,38.1 100.75,52.29 IC13.69
  Bottom 0.152: v64.32,12.68 55.56,21.43 40,21.43 v39.98,21.41 | IC2.N01 37.81,48.92 v29.87,48.92
DA_0  (via drill 0.3)
  Top 0.152: IC3.47 30.65,9.36 v30.48,9.53 | v48.26,9.37 IC4.47
  Bottom 0.152: IC1.5 24.77,11.43 26.67,9.53 v30.48,9.53 48.1,9.53 v48.26,9.37
DA_1  (via drill 0.3)
  Top 0.152: v47.47,8.89 47.47,9.53 47.94,10 48.42,10 48.58,9.84 51.02,9.84 IC4.46 | IC3.46 32.69,9.86 33.02,9.53 v33.02,8.89
  Bottom 0.152: IC1.4 v33.02,8.89 v47.47,8.89
DA_2  (via drill 0.3)
  Top 0.152: IC3.44 32.66,10.86 33.66,9.86 v33.66,6.35 | IC4.44 50.38,10.86 50.16,10.64 48.42,10.64 v48.26,10.79
  Bottom 0.152: IC1.3 v33.66,6.35 46.99,6.35 49.1,8.46 49.1,10.27 48.58,10.79 v48.26,10.79
DA_3  (via drill 0.3)
  Top 0.152: IC3.43 32.81,11.36 34.29,9.87 v34.29,3.81 | IC4.43 49.61,11.36 v49.45,11.2
  Bottom 0.152: IC1.2 v34.29,3.81 46.2,3.81 49.85,7.46 49.85,10.79 v49.45,11.2
DA_4  (via drill 0.3)
  Top 0.152: IC3.41 32.62,12.36 34.92,10.05 v34.92,1.27 | v49.69,12.38 51.01,12.38 IC4.41
  Bottom 0.152: IC1.1 v34.92,1.27 46.2,1.27 50.96,6.03 50.96,11.91 50.48,12.38 v49.69,12.38
DA_5  (via drill 0.3)
  Top 0.152: IC3.40 33.01,12.86 35.56,10.3 v35.56,2.54 | v48.74,12.38 49.37,13.02 50.16,13.02 50.33,12.86 IC4.40
  Bottom 0.152: IC1.64 21.91,1.27 23.18,2.54 v35.56,2.54 45.88,2.54 50.48,7.14 50.48,11.59 50.25,11.82 49.3,11.82 v48.74,12.38
DA_6  (via drill 0.3)